# Altium project Mixed_signal_Board_V1.0.PrjPcb
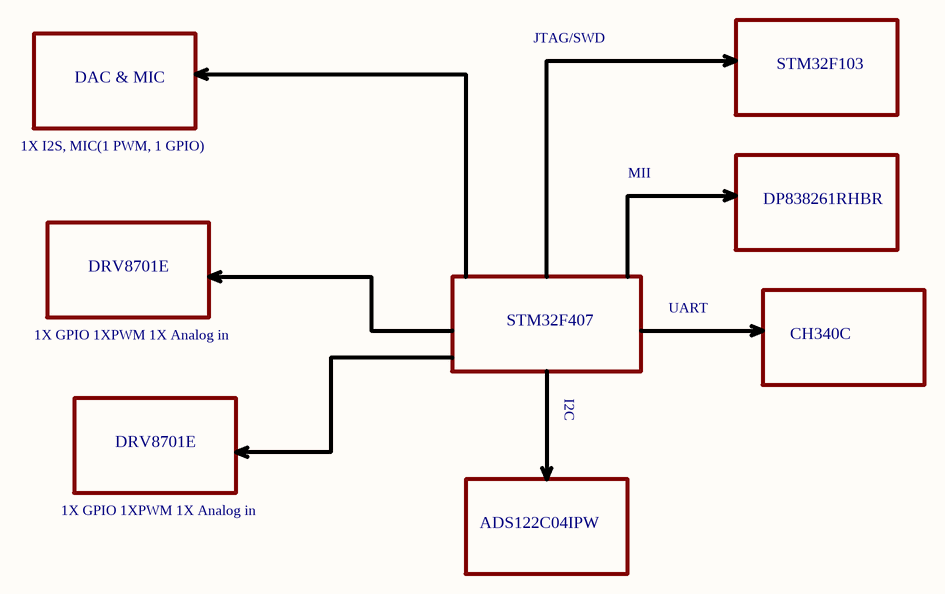
[diagram p0: PCB_Block_diagram.SchDoc]
11 sheets, 184 parts. Net scope: flat (ports and power ports of the same name join across sheets).
Board file: Mixed_signal_Board_V1.0.PcbDoc
Sheets:
  PCB_Block_diagram.SchDoc
  Power_Budget.SchDoc
  STM32F103.SchDoc
  Ethernet PHY.SchDoc
  Motor_Driver_Schematic.SchDoc
  CH340C.SchDoc
  ADC_Chip.SchDoc
  DAC_and_MIC.SchDoc
  Motor_Driver_2.SchDoc
  STM32F407_Controller.SchDoc
  Power_input_and_regulators.SchDoc

## Sheet PCB_Block_diagram.SchDoc
size A4; SheetNumber: 1; SheetTotal: 9

### Notes on the sheet
- JTAG/SWD
- DAC & MIC
- STM32F103
- 1X I2S, MIC(1 PWM, 1 GPIO)
- MII
- DP838261RHBR
- DRV8701E
- STM32F407
- UART
- 1X GPIO 1XPWM 1X Analog in
- I2C
- CH340C
- ADS122C04IPW

## Sheet Power_Budget.SchDoc
size A4; SheetNumber: 2; SheetTotal: 9
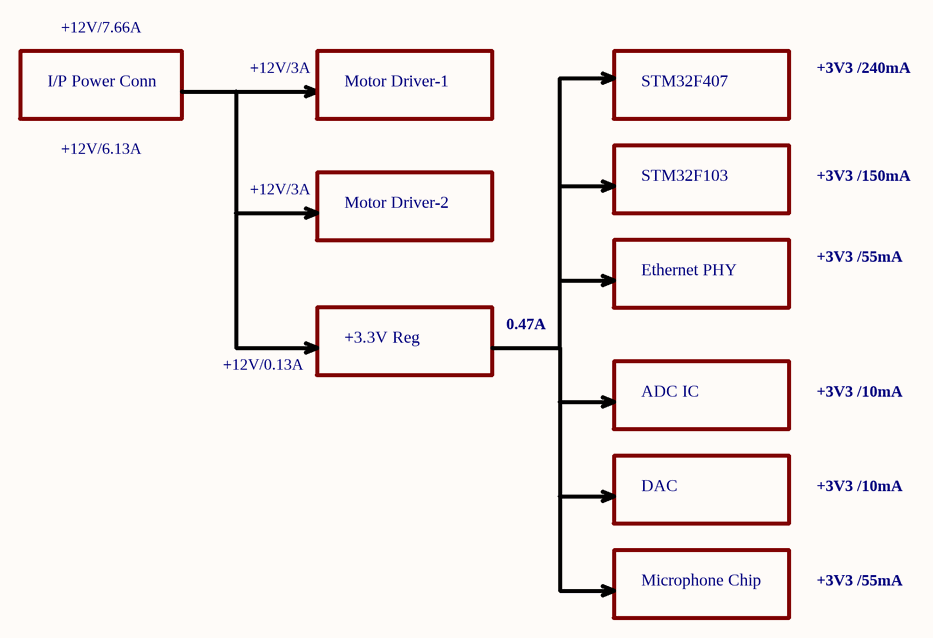
[diagram p1: Power_Budget.SchDoc]

### Notes on the sheet
- I/P Power Conn
- +12V/7.66A
- +12V/3A
- Motor Driver-1
- STM32F407
- +3V3 /240mA
- +12V/6.13A
- Motor Driver-2
- STM32F103
- +3V3 /150mA
- Ethernet PHY
- +3V3 /55mA
- +3.3V Reg
- 0.47A
- +12V/0.13A
- ADC IC
- +3V3 /10mA
- DAC
- Microphone Chip

## Sheet STM32F103.SchDoc
size A4; SheetNumber: 3; SheetTotal: 8
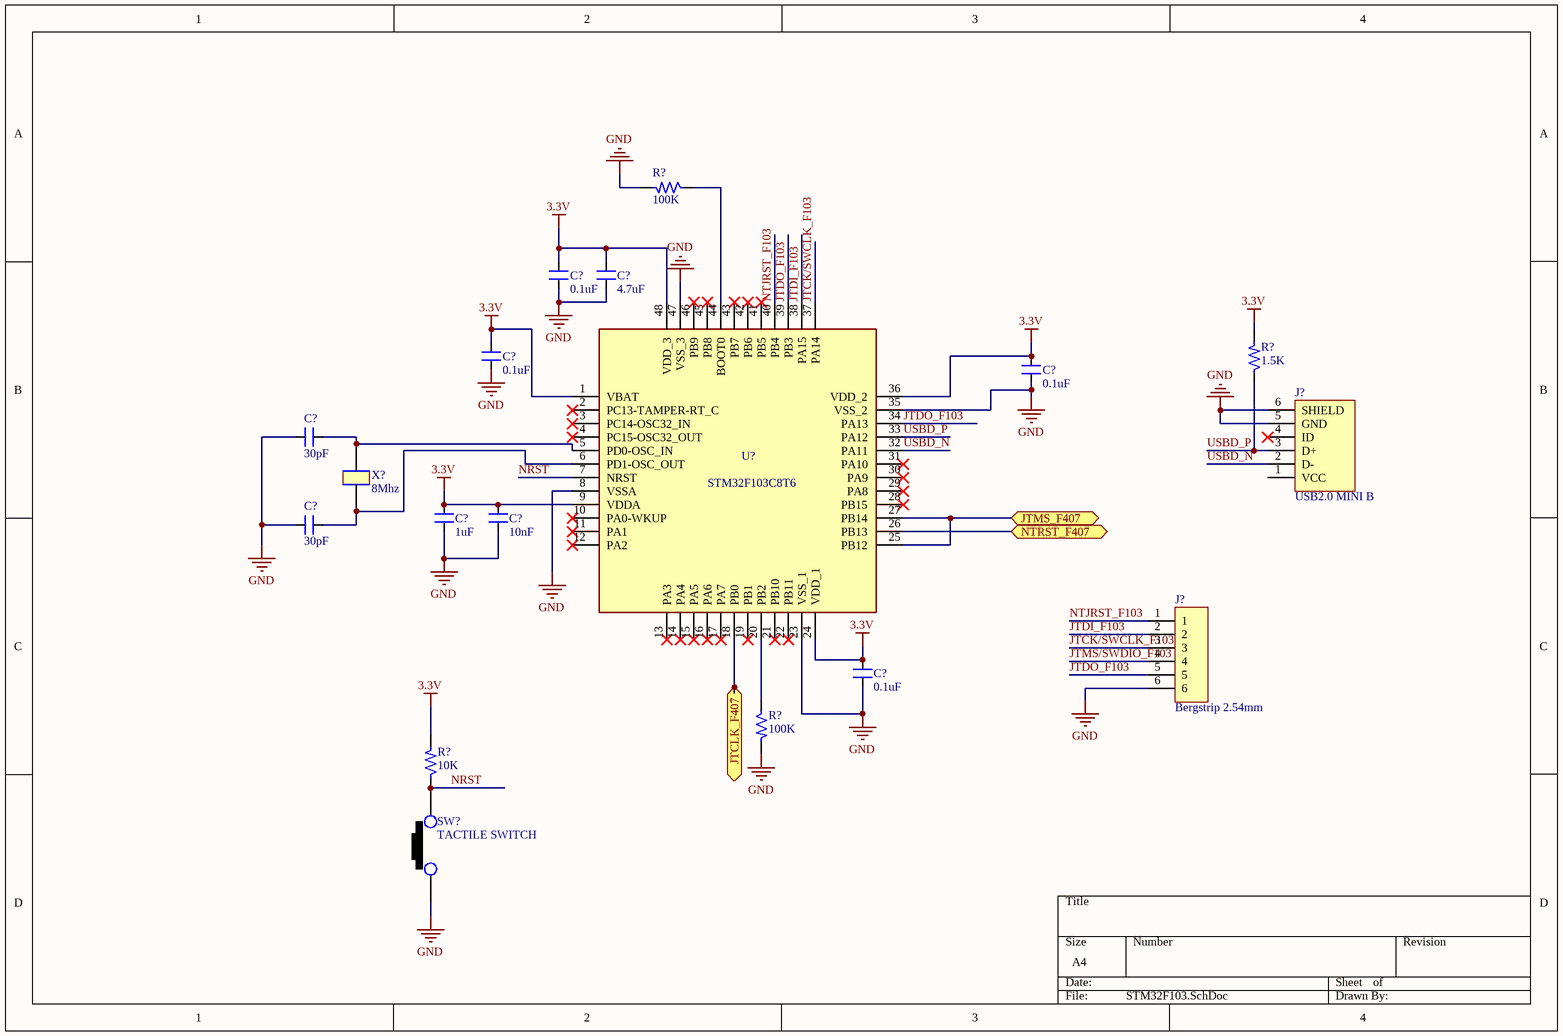
[diagram p2: STM32F103.SchDoc]

### Parts
(Parts that share a designator on the sheet are numbered #1, #2 ... from top to bottom, then left to right.)
C?#1  0.1uF  [CAP_0805]
C?#2  4.7uF  [CAP_0805]
C?#3  0.1uF  [CAP_0805]
C?#4  0.1uF  [CAP_0805]
C?#5  30pF  [CAP_0805]
C?#6  1uF  [CAP_0805]
C?#7  10nF  [CAP_0805]
C?#8  30pF  [CAP_0805]
C?#9  0.1uF  [CAP_0805]
J?#1  USB2.0 MINI B  [CON_690-005-299-043]
J?#2  Bergstrip 2.54mm  [CON6_100_59D78_TH_ST]
R?#1  100K  [RES_0603]
R?#2  1.5K  [RES_0805]
R?#3  100K  [RES_0603]
R?#4  10K  [RES_0805]
SW?#1  TACTILE SWITCH  [SW_342_SMD]
U?#1  STM32F103C8T6  [LQFP-48_19.6_393_58X11_SMD]
X?#1  8Mhz  [XTAL_314_240X47_SMD]

### Ports
JTCLK_F407 (bidir), JTMS_F407 (bidir), NTRST_F407 (bidir)

### Nets
3.3V: C?#1.2 C?#2.2 C?#3.2 C?#4.2 C?#6.2 C?#7.2 C?#9.2 R?#2.2 R?#4.2 U?#1.1(VBAT) U?#1.9(VDDA) U?#1.24(VDD_1) U?#1.36(VDD_2) U?#1.48(VDD_3)
GND: C?#1.1 C?#2.1 C?#3.1 C?#4.1 C?#5.2 C?#6.1 C?#7.1 C?#8.2 C?#9.1 J?#1.5(GND) J?#1.6(SHIELD) J?#2.6 R?#1.2 R?#3.2 SW?#1.1 U?#1.8(VSSA) U?#1.23(VSS_1) U?#1.35(VSS_2) U?#1.47(VSS_3)  [project net SN]
JTCK/SWCLK_F103: J?#2.3 U?#1.37(PA14)
JTCLK_F407: U?#1.18(PB0) ; port JTCLK_F407
JTDI_F103: J?#2.2 U?#1.38(PA15)
JTDO_F103: J?#2.5 U?#1.34(PA13) U?#1.39(PB3)
JTMS/SWDIO_F103: J?#2.4
JTMS_F407: U?#1.25(PB12) U?#1.27(PB14) ; port JTMS_F407
NRST: R?#4.1 SW?#1.2 U?#1.7(NRST)
NTJRST_F103: J?#2.1 U?#1.40(PB4)
NTRST_F407: U?#1.26(PB13) ; port NTRST_F407
USBD_N: J?#1.2(D-) U?#1.32(PA11)
USBD_P: J?#1.3(D+) R?#2.1 U?#1.33(PA12)
NetC?#5_1: C?#5.1 U?#1.5(PD0-OSC_IN) X?#1.2
NetC?#8_1: C?#8.1 U?#1.6(PD1-OSC_OUT) X?#1.1
NetR?#1_1: R?#1.1 U?#1.44(BOOT0)
NetR?#3_1: R?#3.1 U?#1.20(PB2)

Not connected (* = marked no-connect by the designer): J?#1 1(VCC) 4(ID)*; U?#1 2(PC13-TAMPER-RT_C)* 3(PC14-OSC32_IN)* 4(PC15-OSC32_OUT)* 10(PA0-WKUP)* 11(PA1)* 12(PA2)* 13(PA3)* 14(PA4)* 15(PA5)* 16(PA6)* 17(PA7)* 19(PB1)* 21(PB10)* 22(PB11)* 28(PB15)* 29(PA8)* 30(PA9)* 31(PA10)* 41(PB5)* 42(PB6)* 43(PB7)* 45(PB8)* 46(PB9)*

### Library data of the parts
C?#1 C?#4 C?#9 = CAP_0.1uF-50V-10%-0805: 0.1µF ±10% 50V Ceramic Capacitor X7R 0805 (2012 Metric); Manufacturer: Samsung; Manufacturer Part Number: CL21B104KBCNNNC; Alternate Part Number-1: NA; Case/Package: 0805; Supplier-1: SIRICOM; Supplier Part Number-1: 0805B104K500CT
C?#2 = CAP_4.7uF-50V-10%-0805: 4.7µF ±10% 50V Ceramic Capacitor X5R 0805 (2012 Metric); Manufacturer: Yageo; Manufacturer Part Number: GRM21BR61H475KE51L; Alternate Part Number-1: NA; Case/Package: 0805; Supplier-1: SIRICOM; Supplier Part Number-1: CL21A475KBQNNNE
C?#3 = CAP_0.1uF-50V-5%-0805: 0.1µF ±5% 50V Ceramic Capacitor X7R 0805 (2012 Metric); Manufacturer: AVX Corporation; Manufacturer Part Number: 08055C104JAT4A; Alternate Part Number-1: 0805B104M500; Case/Package: 0805; Supplier-1: SIRICOM; Supplier Part Number-1: 0805B104J500CT
C?#5 C?#8 = CAP_30pF-50V-10%-0805: ±10% 50V Ceramic Capacitor C0G, NP0 0805 (2012 Metric); Manufacturer Part Number: C0805C300K5GAC7800; Manufacturer: KEMET; Alternate Part Number: NA; Case/Package: 0805; Supplier-1: Digikey; Supplier Part Number-1: 399-17443-1-ND - Cut Tape (CT)
C?#6 = CAP_1uF-50V-5%-0805: 1µF ±5% 50V Ceramic Capacitor X7R 0805 (2012 Metric); Manufacturer: Samsung; Manufacturer Part Number: CC0805JKX7R9BB105; Alternate Part Number-1: 0805F105M500NT; Case/Package: 0805; Supplier-1: SIRICOM; Supplier Part Number-1: CL21B105KBFNNNE
C?#7 = CAP_10nF-50V-10%-0805: 10000pF ±10% 50V Ceramic Capacitor X7R 0805 (2012 Metric); Manufacturer: Samsung; Manufacturer Part Number: C0805C103K5RECAUTO; Alternate Part Number-1: GRM2195C1H103JA01D; Case/Package: 0805; Supplier-1: SIRICOM; Supplier Part Number-1: 0805B103K500CT
J?#1 = CON_USB2.0-MINIB-SMD: USB - mini B USB 2.0 Receptacle Connector 5 Position Surface Mount, Right Angle; Manufacturer: EDAC; Manufacturer Part Number: 690-005-299-043; Alternate Part Number-1: NA; Case/Package: USB-MINI-B; Supplier-1: LCSC; Supplier Part Number-1: C105424
J?#2 = CON-BS-SKT_6X1-100-ST-TH: 6 Pins, 1 Row 2.54mm Pitch, Straight bergstrip, Female; Manufacturer: Molex; Alternate Part Number-1: NA; Manufacturer Part Number: 22-10-2061; Case/Package: TH-CON; Supplier-1: SP ROAD; Supplier Part Number-1: NA
R?#1 R?#3 = RES_100K-0.1W-1%-0603: 100 kOhms ±1% 0.1W, 1/10W Chip Resistor 0603 (1608 Metric) Automotive AEC-Q200 Thick Film; Manufacturer: Stackpole Electronics; Manufacturer Part Number: RMCF0603FT100K; Alternate Part Number-1: NA; Case/Package: 0603; Supplier-1: Arrow; Supplier Part Number-1: RMCF0603FT100K
R?#2 = RES_1.5K-0.125W-1%-0805: 1.5 kOhms ±1% 0.125W, 1/8W Chip Resistor 0805 (2012 Metric) Thick Film; Manufacturer: TE Connectivity Passive Product; Manufacturer Part Number: CRG0805F1K5; Alternate Part Number-1: NA; Case/Package: 0805; Supplier-1: SIRICOM; Supplier Part Number-1: NA
R?#4 = RES_10K-0.125W-1%-0805: 10 kOhms ±1% 0.125W, 1/8W Chip Resistor 0805 (2012 Metric) Automotive AEC-Q200 Thick Film; Manufacturer: CTS; Manufacturer Part Number: WR08X1002FTL; Case/Package: 0805; Supplier-1: SIRICOM; Supplier Part Number-1: WR08X1002FTL; Alternate Part Number-1: WR08X1002FTL
SW?#1 = SW1_RS-282G05A3-SMRT-SMD: Tactile Switch SPST-NO Top Actuated Surface Mount; Manufacturer: ITT C&K; Alternate Part Number-1: NA; Manufacturer Part Number: RS-282G05A3-SMRT; Case/Package: SMD; Supplier-1: SP ROAD; Supplier Part Number-1: RS-282G05A3-SMRT
U?#1 = IC_STM32F103C8T6: ARM® Cortex®-M3 STM32F1 Microcontroller IC 32-Bit 72MHz 64KB (64K x 8) FLASH 48-LQFP (7x7); Manufacturer: STMicroelectronics; Alternate Part Number-1: NA; Manufacturer Part Number: STM32F103C8T6; Case/Package: LQFP48; Supplier-1: LCSC; Supplier Part Number-1: STM32F103C8T6
X?#1 = XTAL_8MHZ-ECS-80-32-5PX-SMD: 8MHz ±30ppm Crystal 32pF 60 Ohms HC-49/US; Manufacturer: Fox Electronics; Manufacturer Part Number: ECS-80-32-5PX-TR; Alternate Part Number-1: NA; Case/Package: SMD/SMT; Supplier-1: SP ROAD; Supplier Part Number-1: ECS-80-32-5PX-TR

## Sheet Ethernet PHY.SchDoc
size A4; SheetNumber: 4; SheetTotal: 9
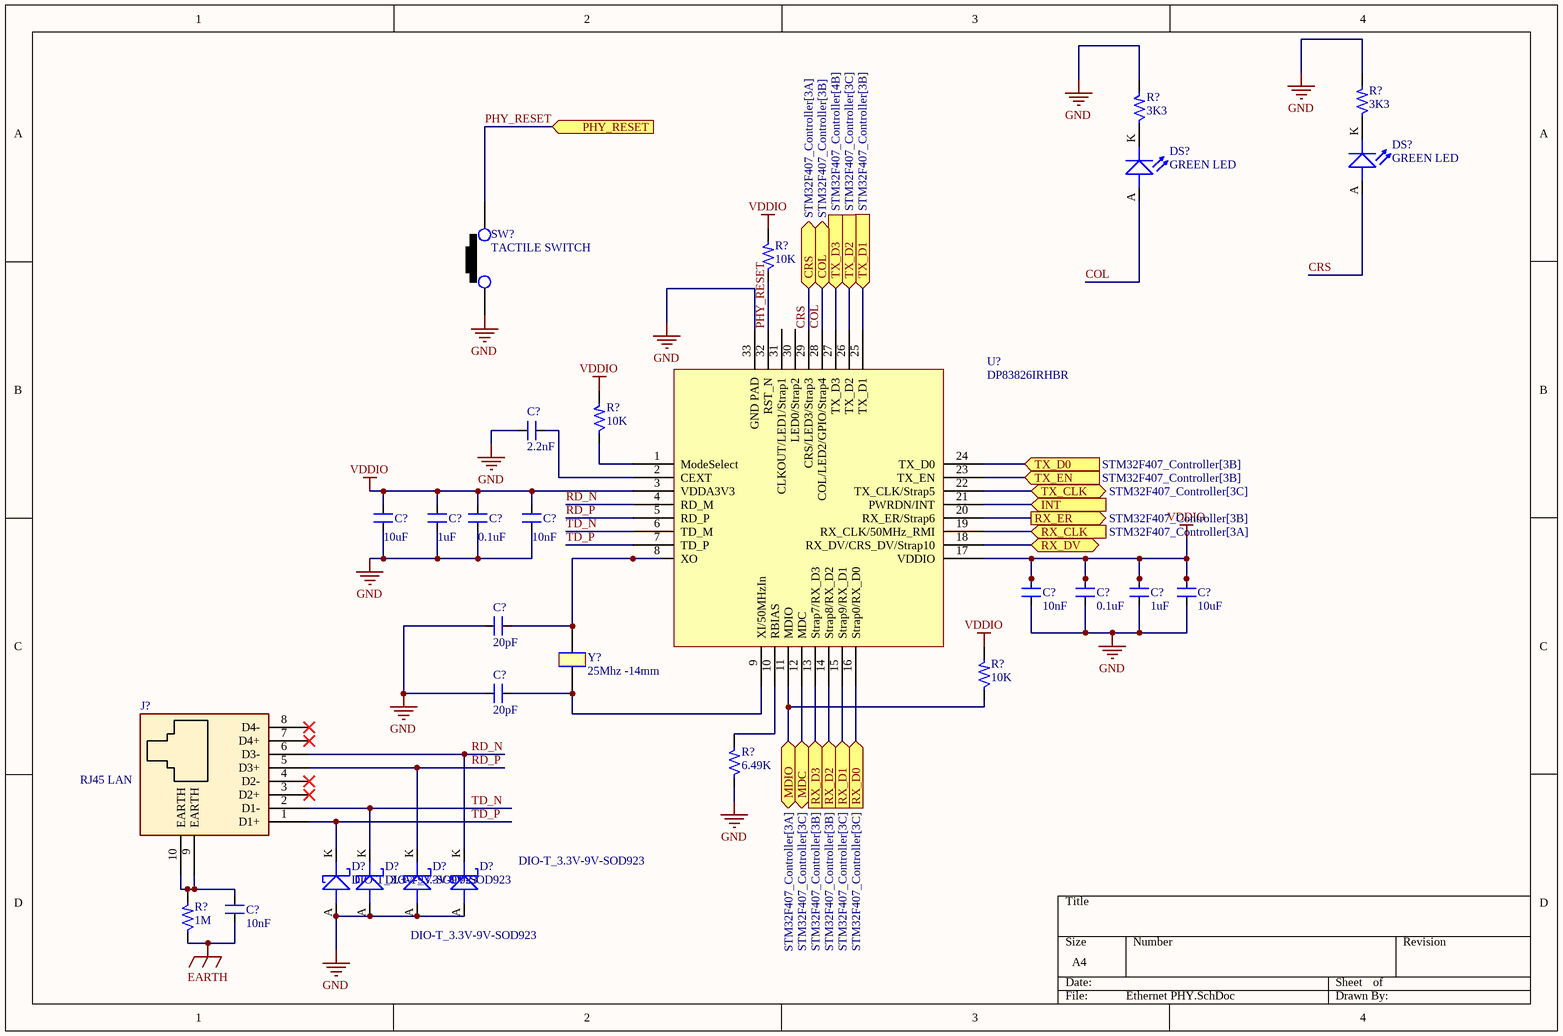
[diagram p3: Ethernet PHY.SchDoc]

### Parts
(Parts that share a designator on the sheet are numbered #1, #2 ... from top to bottom, then left to right.)
C?#10  2.2nF  [CAP_0805]
C?#11  10uF  [CAP_1206]
C?#12  1uF  [CAP_0805]
C?#13  0.1uF  [CAP_0805]
C?#14  10nF  [CAP_0805]
C?#15  10nF  [CAP_0805]
C?#16  0.1uF  [CAP_0805]
C?#17  1uF  [CAP_0805]
C?#18  10uF  [CAP_1206]
C?#19  20pF  [CAP_0805]
C?#20  20pF  [CAP_0805]
C?#21  10nF  [CAP_P196_102X287_H332_RAD_TH]
D?#1  DIO-T_3.3V-9V-SOD923
D?#2  DIO-T_3.3V-9V-SOD923
D?#3  DIO-T_3.3V-9V-SOD923
D?#4  DIO-T_3.3V-9V-SOD923
DS?#1  GREEN LED  [LED_0805]
DS?#2  GREEN LED  [LED_0805]
J?#3  RJ45 LAN  [CON10_P106_RJ45_TH_ST]
R?#5  3K3  [RES_0603]
R?#6  3K3  [RES_0603]
R?#7  10K  [RES_0805]
R?#8  10K  [RES_0805]
R?#9  10K  [RES_0805]
R?#10  6.49K  [RES_0805]
R?#11  1M  [RES_1206]
SW?#2  TACTILE SWITCH  [SW_342_SMD]
U?#2  DP83826IRHBR  [VQFN32_19_218_23X9_SMD]
Y?  25Mhz -14mm  [XTAL_314_240X47_SMD]

### Ports
COL (bidir, see STM32F407_Controller[3B]), CRS (bidir, see STM32F407_Controller[3A]), INT (in), MDC (bidir, see STM32F407_Controller[3C]), MDIO (bidir, see STM32F407_Controller[3A]), PHY_RESET (in), RX_CLK (in, see STM32F407_Controller[3A]), RX_D0 (in, see STM32F407_Controller[3C]), RX_D1 (in, see STM32F407_Controller[3C]), RX_D2 (in, see STM32F407_Controller[3B]), RX_D3 (in, see STM32F407_Controller[3B]), RX_DV (bidir), RX_ER (out, see STM32F407_Controller[3B]), TX_CLK (bidir, see STM32F407_Controller[3C]), TX_D0 (in, see STM32F407_Controller[3B]), TX_D1 (in, see STM32F407_Controller[3B]), TX_D2 (in, see STM32F407_Controller[3C]), TX_D3 (in, see STM32F407_Controller[4B]), TX_EN (in, see STM32F407_Controller[3B])

### Nets
EARTH: C?#21.1 R?#11.1
GND: C?#10.1 C?#11.1 C?#12.1 C?#13.1 C?#14.1 C?#15.2 C?#16.2 C?#17.2 C?#18.2 C?#19.2 C?#20.2 D?#1.A D?#2.A D?#3.A D?#4.A R?#5.2 R?#6.2 R?#10.1 SW?#2.1 U?#2.33(GND_PAD)  [project net SN]
VDDIO: C?#11.2 C?#12.2 C?#13.2 C?#14.2 C?#15.1 C?#16.1 C?#17.1 C?#18.1 R?#7.2 R?#8.2 R?#9.2 U?#2.3(VDDA3V3) U?#2.17(VDDIO)
COL: DS?#2.A(ANODE) U?#2.28(COL/LED2/GPIO/Strap4) ; port COL
CRS: DS?#1.A(ANODE) U?#2.29(CRS/LED3/Strap3) ; port CRS
INT: U?#2.21(PWRDN/INT) ; port INT
MDC: U?#2.12(MDC) ; port MDC
MDIO: R?#9.1 U?#2.11(MDIO) ; port MDIO
PHY_RESET: R?#7.1 SW?#2.2 U?#2.32(RST_N) ; port PHY_RESET
RD_N: D?#4.K J?#3.6(D3-) U?#2.4(RD_M)
RD_P: D?#3.K J?#3.5(D3+) U?#2.5(RD_P)
RX_CLK: U?#2.19(RX_CLK/50MHz_RMI) ; port RX_CLK
RX_D0: U?#2.16(Strap0/RX_D0) ; port RX_D0
RX_D1: U?#2.15(Strap9/RX_D1) ; port RX_D1
RX_D2: U?#2.14(Strap8/RX_D2) ; port RX_D2
RX_D3: U?#2.13(Strap7/RX_D3) ; port RX_D3
RX_DV: U?#2.18(RX_DV/CRS_DV/Strap10) ; port RX_DV
RX_ER: U?#2.20(RX_ER/Strap6) ; port RX_ER
TD_N: D?#2.K J?#3.2(D1-) U?#2.6(TD_M)
TD_P: D?#1.K J?#3.1(D1+) U?#2.7(TD_P)
TX_CLK: U?#2.22(TX_CLK/Strap5) ; port TX_CLK
TX_D0: U?#2.24(TX_D0) ; port TX_D0
TX_D1: U?#2.25(TX_D1) ; port TX_D1
TX_D2: U?#2.26(TX_D2) ; port TX_D2
TX_D3: U?#2.27(TX_D3) ; port TX_D3
TX_EN: U?#2.23(TX_EN) ; port TX_EN
NetC?#10_2: C?#10.2 U?#2.2(CEXT)
NetC?#19_1: C?#19.1 U?#2.8(XO) Y?.2
NetC?#20_1: C?#20.1 U?#2.9(XI/50MHzIn) Y?.1
NetC?#21_2: C?#21.2 J?#3.9(EARTH) J?#3.10(EARTH) R?#11.2
NetDS?#1_K: DS?#1.K(CATHODE) R?#5.1
NetDS?#2_K: DS?#2.K(CATHODE) R?#6.1
NetR?#8_1: R?#8.1 U?#2.1(ModeSelect)
NetR?#10_2: R?#10.2 U?#2.10(RBIAS)

Not connected (* = marked no-connect by the designer): J?#3 3(D2+)* 4(D2-)* 7(D4+)* 8(D4-)*; U?#2 30(LED0/Strap2) 31(CLKOUT/LED1/Strap1)

### Library data of the parts
C?#10 = CAP_2.2nF-50V-10%-0805: 2200pF ±10% 50V Ceramic Capacitor C0G, NP0 0805 (2012 Metric); Manufacturer: KEMET; Manufacturer Part Number: C0805C222K5GEC7800; Alternate Part Number-1: NA; Case/Package: 0805; Supplier-1: SIRICOM; Supplier Part Number-1: 0805N222J500LT
C?#11 C?#18 = CAP_10uF-50V-10%-1206: 10µF ±10% 50V Ceramic Capacitor X7R 1206 (3216 Metric); Manufacturer: KEMET; Manufacturer Part Number: CL31B106KBHNNNE; Alternate Part Number-1: GRT31CR61H106ME01L; Case/Package: 1206; Supplier-1: SIRICOM; Supplier Part Number-1: CC1206KKX5R9BB106
C?#12 C?#17 = CAP_1uF-50V-5%-0805: as C?#6 on sheet STM32F103; Case/Package: 0805; Supplier-1: SIRICOM; Supplier Part Number-1: CL21B105KBFNNNE
C?#13 C?#16 = CAP_0.1uF-50V-10%-0805: as C?#1 on sheet STM32F103; Case/Package: 0805; Supplier-1: SIRICOM; Supplier Part Number-1: 0805B104K500CT
C?#14 C?#15 = CAP_10nF-50V-10%-0805: as C?#7 on sheet STM32F103; Case/Package: 0805; Supplier-1: SIRICOM; Supplier Part Number-1: 0805B103K500CT
C?#19 C?#20 = CAP_20pF-50V-10%-0805: ±10% 50V Ceramic Capacitor C0G, NP0 0805 (2012 Metric); Manufacturer: AVX Corporation; Manufacturer Part Number: 08055A200KAT2A; Alternate Part Number-1: NA; Case/Package: 0805; Supplier-1: Digikey; Supplier Part Number-1: 478-11887-1-ND - Cut Tape (CT)
C?#21 = CAP_10nF-1KV-10%-RAD-TH: 10000pF ±10% 1000V (1kV) Ceramic Capacitor X7R Radial; Manufacturer: Yageo; Manufacturer Part Number: RDER73A103K2K1H03B; Alternate Part Number-1: NA; Case/Package: TH; Supplier-1: SP ROAD; Supplier Part Number-1: RDER73A103K2K1H03B
DS?#1 DS?#2 = LED_GREEN-2.2-20mA-0805: Green 569nm LED Indication - Discrete 2.1V 0805 (2012 Metric); Manufacturer: Vishay Lite-On; Manufacturer Part Number: LTST-C171GKT; Alternate Part Number-1: NA; Case/Package: 0805; Supplier-1: SP ROAD; Supplier Part Number-1: LTST-C171GKT
J?#3 = CON-SKT-RJ_8C8P-RA-TH: 8 Pins, 2 Row 2.54mm Pitch, right angle Connector, male; Manufacturer: Assmann; Manufacturer Part Number: A-2004-2-4-LPS-N-R; Alternate Part Number-1: NA; Case/Package: TH-CON; Supplier-1: SP ROAD; Supplier Part Number-1: A-2004-2-4-LPS-N-R
R?#5 R?#6 = RES_3.3K-0.1W-1%-0603: 3.3 kOhms ±1% 0.1W, 1/10W Chip Resistor 0603 (1608 Metric) Automotive AEC-Q200 Thick Film; Manufacturer: Wilson; Manufacturer Part Number: WR06X3301FTL; Alternate Part Number-1: 0603WAF3301T5E; Case/Package: 0603; Supplier-1: SIRICOM; Supplier Part Number-1: WR06X3301FTL
R?#7-R?#9 = RES_10K-0.125W-1%-0805: as R?#4 on sheet STM32F103; Case/Package: 0805; Supplier-1: SIRICOM; Supplier Part Number-1: WR08X1002FTL; Alternate Part Number-1: WR08X1002FTL
R?#10 = RES_6.49K-0.125W-1%-0805: 6.49 kOhms ±1% 0.125W, 1/8W Chip Resistor 0805 (2012 Metric) Moisture Resistant Thick Film; Manufacturer: Stackpole Electronics; Manufacturer Part Number: RC0805FR-076K49L; Alternate Part Number-1: NA; Case/Package: 0805; Supplier-1: SIRICOM; Supplier Part Number-1: WRO8X6491FTL
R?#11 = RES_1M-0.25W-1%-1206: 1 MOhms ±1% 0.25W, 1/4W Chip Resistor 1206 (3216 Metric) Automotive AEC-Q200, High Voltage Thick Film; Manufacturer: Walsin; Manufacturer Part Number: WR12X1004FTL; Alternate Part Number-1: NA; Case/Package: 1206; Supplier-1: SIRICOM; Supplier Part Number-1: WR12X1004FTL
SW?#2 = SW1_RS-282G05A3-SMRT-SMD: as SW?#1 on sheet STM32F103; Manufacturer Part Number: RS-282G05A3-SMRT; Case/Package: SMD; Supplier-1: SP ROAD; Supplier Part Number-1: RS-282G05A3-SMRT
U?#2 = IC_DP83826IRHBR: Ethernet ICs Low latency 10/100-Mbps PHY, MII interface and enhanced mode with an industrial temperature range 32-VQFN -40 to 85; Manufacturer: Texas Instruments; Alternate Part Number-1: NA; Manufacturer Part Number: DP83826IRHBR; Case/Package: 32-VQFN; Supplier-1: Mouser; Supplier Part Number-1: 595-DP83826IRHBR
Y? = XTAL_25Mhz-FOXSDLF/250F-20: 25MHz ±30ppm Crystal 20pF 30 Ohms HC-49/US; Manufacturer: Abracon; Alternate Part Number-1: NA; Manufacturer Part Number: FOXSDLF/250F-20; Case/Package: SMD; Supplier-1: MOUSER; Supplier Part Number-1: FOXSDLF/250F-20

## Sheet Motor_Driver_Schematic.SchDoc
size A4; SheetNumber: 5; SheetTotal: 10
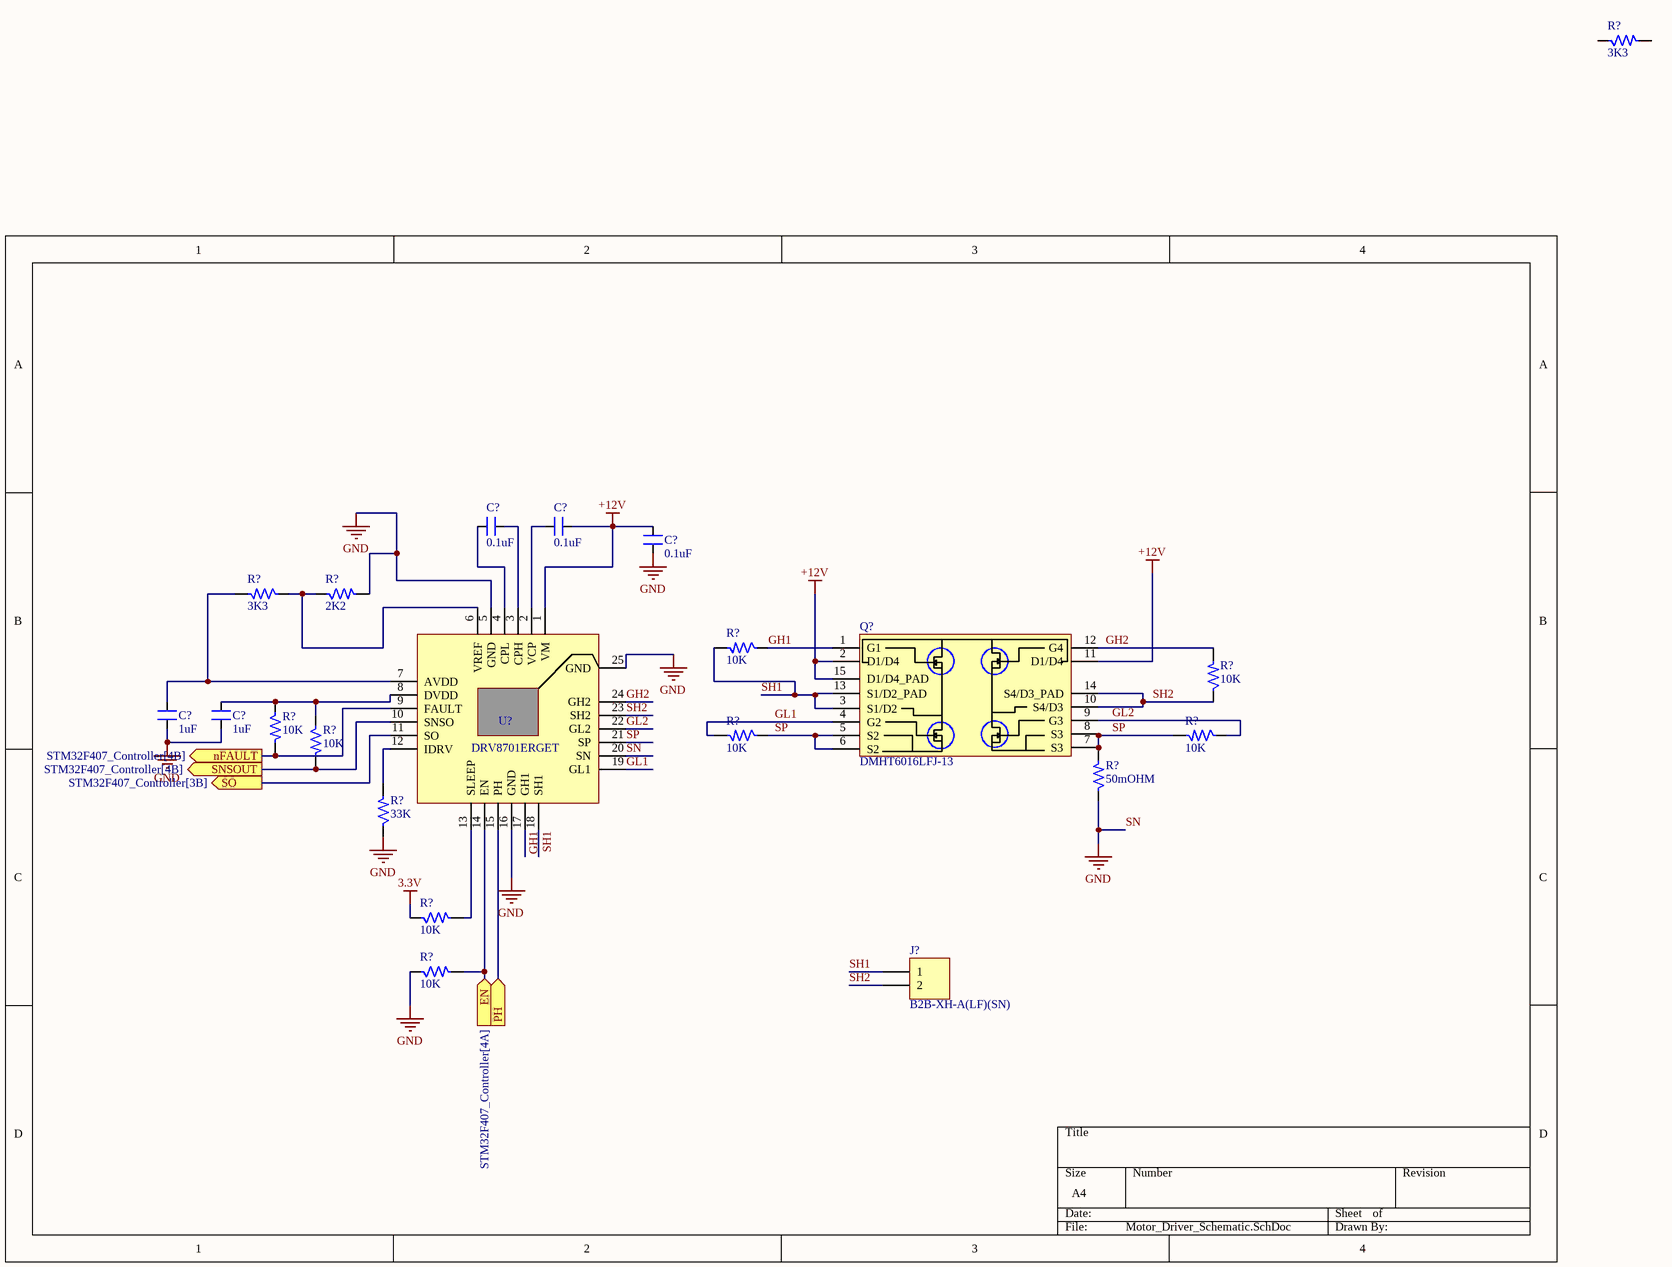
[diagram p4: Motor_Driver_Schematic.SchDoc]

### Parts
(Parts that share a designator on the sheet are numbered #1, #2 ... from top to bottom, then left to right.)
C?#22  0.1uF  [CAP_0805]
C?#23  0.1uF  [CAP_0805]
C?#24  0.1uF  [CAP_0805]
C?#25  1uF  [CAP_0805]
C?#26  1uF  [CAP_0805]
J?#4  B2B-XH-A(LF)(SN)  [CON2_100_B2B-XH-A_TH_ST]
Q?#1  DMHT6016LFJ-13  [DFN5045-12_33_212_27X15_SMD_1]
R?#12  3K3  [RES_0603]
R?#13  3K3  [RES_0603]
R?#14  2K2  [RES_0603]
R?#15  10K  [RES_0805]
R?#16  10K  [RES_0805]
R?#17  10K  [RES_0805]
R?#18  10K  [RES_0805]
R?#19  10K  [RES_0805]
R?#20  10K  [RES_0805]
R?#21  50mOHM  [RES_2512]
R?#22  33K  [RES_0805]
R?#23  10K  [RES_0603]
R?#24  10K  [RES_0805]
U?#3  DRV8701ERGET  [VFQFN24_19.6_196_12X32_SMD_1]

### Ports
EN (in, see STM32F407_Controller[4A]), nFAULT (out, see STM32F407_Controller[4B]), PH (in), SNSOUT (out, see STM32F407_Controller[4B]), SO (out, see STM32F407_Controller[3B])

### Nets
3.3V: R?#23.1
+12V: C?#23.1 C?#24.2 Q?#1.2(D1/D4) Q?#1.11(D1/D4) Q?#1.15(D1/D4_PAD) U?#3.1(VM)
SN: C?#24.1 C?#25.1 C?#26.1 R?#14.2 R?#21.1 R?#22.1 R?#24.1 U?#3.5(GND) U?#3.16(GND) U?#3.20(SN) U?#3.25(GND)  [also labelled GND]
EN: R?#24.2 U?#3.14(EN) ; port EN
GH1: Q?#1.1(G1) R?#15.1 U?#3.17(GH1)
GH2: Q?#1.12(G4) R?#17.2 U?#3.24(GH2)
GL1: Q?#1.4(G2) R?#19.2 U?#3.19(GL1)
GL2: Q?#1.9(G3) R?#20.1 U?#3.22(GL2)
nFAULT: R?#16.2 U?#3.9(FAULT) ; port nFAULT
PH: U?#3.15(PH) ; port PH
SH1: J?#4.1 Q?#1.3(S1/D2) Q?#1.13(S1/D2_PAD) R?#15.2 U?#3.18(SH1)
SH2: J?#4.2 Q?#1.10(S4/D3) Q?#1.14(S4/D3_PAD) R?#17.1 U?#3.23(SH2)
SNSOUT: R?#18.2 U?#3.10(SNSO) ; port SNSOUT
SO: U?#3.11(SO) ; port SO
SP: Q?#1.5(S2) Q?#1.6(S2) Q?#1.7(S3) Q?#1.8(S3) R?#19.1 R?#20.2 R?#21.2 U?#3.21(SP)
NetC?#22_1: C?#22.1 U?#3.3(CPH)
NetC?#22_2: C?#22.2 U?#3.4(CPL)
NetC?#23_2: C?#23.2 U?#3.2(VCP)
NetC?#25_2: C?#25.2 R?#13.2 U?#3.7(AVDD)
NetC?#26_2: C?#26.2 R?#16.1 R?#18.1 U?#3.8(DVDD)
NetR?#13_1: R?#13.1 R?#14.1 U?#3.6(VREF)
NetR?#22_2: R?#22.2 U?#3.12(IDRV)
NetR?#23_2: R?#23.2 U?#3.13(SLEEP)

Not connected (* = marked no-connect by the designer): R?#12 1 2

### Library data of the parts
C?#22-C?#24 = CAP_0.1uF-50V-20%-0805: 0.1µF ±20% 50V Ceramic Capacitor X7R 0805 (2012 Metric); Manufacturer: Samsung Electro-Mechanics; Manufacturer Part Number: CL21B104MBCNNNC; Alternate Part Number-1: NA; Case/Package: 0805; Supplier-1: SIRICOM; Supplier Part Number-1: 0805B104K500CT
C?#25 C?#26 = CAP_1uF-50V-5%-0805: as C?#6 on sheet STM32F103; Case/Package: 0805; Supplier-1: SIRICOM; Supplier Part Number-1: CL21B105KBFNNNE
J?#4 = CON-PLG_2X1-100-ST-TH: 2 Pins, 1 Row 2.54mm Pitch, Straight Connector, male; Manufacturer: JST; Mating Part Number: XHP-2; Crimp Part Number: ASXHSXH22K51; Alternate Part Number-1: NA; Manufacturer Part Number: B2B-XH-A(LF)(SN); Case/Package: TH-CON; Supplier-1: SP ROAD; Supplier Part Number-1: B2B-XH-A(LF)(SN)
Q?#1 = MOSFET-N_60V-14.8A-V-DFN5045-12: Mosfet Array 4 N-Channel 14.8A (Ta) Surface Mount V-DFN5045-12; Manufacturer: ON Semiconductor; Alternate Part Number-1: DMHT3006LFJ-13; Manufacturer Part Number: DMHT6016LFJ-13; Case/Package: DFN5045-12; Supplier-1: LCSC; Supplier Part Number-1: C460986
R?#12 R?#13 = RES_3.3K-0.1W-1%-0603: as R?#5 on sheet Ethernet PHY; Case/Package: 0603; Supplier-1: SIRICOM; Supplier Part Number-1: WR06X3301FTL
R?#14 = RES_2K2-0.1W-5%-0603: 2.2 kOhms ±5% 0.1W, 1/10W Chip Resistor 0603 (1608 Metric) Automotive AEC-Q200 Thick Film; Manufacturer: Stackpole Electronics; Manufacturer Part Number: ERJ-3GEYJ222V; Alternate Part Number-1: WR06X2201FTL; Case/Package: 0603; Supplier-1: SIRICOM; Supplier Part Number-1: WR06X2201FTL
R?#15-R?#20 R?#24 = RES_10K-0.125W-1%-0805: as R?#4 on sheet STM32F103; Case/Package: 0805; Supplier-1: SIRICOM; Supplier Part Number-1: WR08X1002FTL; Alternate Part Number-1: WR08X1002FTL
R?#21 = RES_50mOhm-2W-1%-2512: 50 mOhms ±1% 2W Chip Resistor 2512 (6432 Metric) Automotive AEC-Q200, Current Sense, Moisture Resistant Metal Element; Manufacturer: Yageo; Manufacturer Part Number: PA2512FKF7W0R05E; Alternate Part Number-1: PMR100HZPFU5L00; Case/Package: 2512; Supplier-1: SIRICOM; Supplier Part Number-1: LR2512-22R060F1
R?#22 = RES_33K-0.125W-1%-0805: Thick Film Resistors - SMD 33KOhms 1/8W 150V33 kOhms ±1% 0.125W, 1/8W Chip Resistor 0805 (2012 Metric) Thick Film; Manufacturer: Vishay BCcomponents; Manufacturer Part Number: CRG0805F33K; Alternate Part Number-1: NA; Case/Package: 0805; Supplier-1: SIRICOM; Supplier Part Number-1: WR08X3302FTL
R?#23 = RES_10K-0.1W-1%-0603: 10 kOhms ±1% 0.1W, 1/10W Chip Resistor 0603 (1608 Metric) Automotive AEC-Q200 Thick Film; Manufacturer: Walsin; Manufacturer Part Number: WR06X1002FTL; Alternate Part Number-1: 0603WAJ0103T5E; Case/Package: 0603; Supplier-1: SIRICOM; Supplier Part Number-1: WR06X1002FTL
U?#3 = IC_DRV8701ERGET: Motor Driver Power MOSFET Parallel 24-VQFN (4x4); Manufacturer: Texas Instruments; Alternate Part Number-1: NA; Manufacturer Part Number: DRV8701ERGET; Case/Package: VFQFN24; Supplier-1: ARROW; Supplier Part Number-1: DRV8701ERGET

## Sheet CH340C.SchDoc
size A4; SheetNumber: 6; SheetTotal: 9
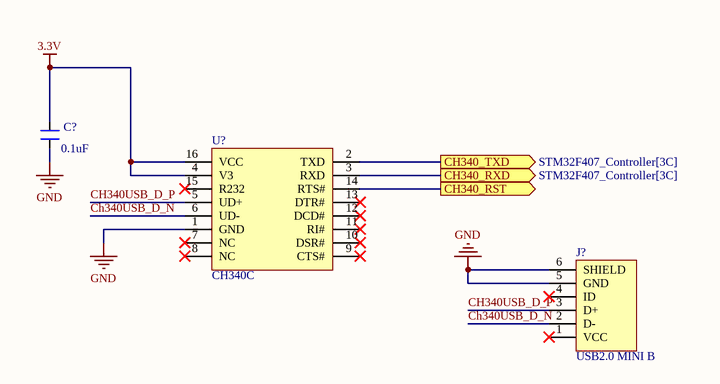
[diagram p5: CH340C.SchDoc]

### Parts
(Parts that share a designator on the sheet are numbered #1, #2 ... from top to bottom, then left to right.)
C?#27  0.1uF  [CAP_0805]
J?#5  USB2.0 MINI B  [CON_690-005-299-043]
U?#4  CH340C  [SOIC16_50_284_25X90_SMT]

### Ports
CH340_RST (out), CH340_RXD (out, see STM32F407_Controller[3C]), CH340_TXD (out, see STM32F407_Controller[3C])

### Nets
3.3V: C?#27.2 U?#4.4(V3) U?#4.16(VCC)
GND: C?#27.1 J?#5.5(GND) J?#5.6(SHIELD) U?#4.1(GND)  [project net SN]
CH340_RST: U?#4.14(RTS#) ; port CH340_RST
CH340_RXD: U?#4.3(RXD) ; port CH340_RXD
CH340_TXD: U?#4.2(TXD) ; port CH340_TXD
Ch340USB_D_N: J?#5.2(D-) U?#4.6(UD-)
CH340USB_D_P: J?#5.3(D+) U?#4.5(UD+)

Not connected (* = marked no-connect by the designer): J?#5 1(VCC)* 4(ID)*; U?#4 7(NC)* 8(NC)* 9(CTS#)* 10(DSR#)* 11(RI#)* 12(DCD#)* 13(DTR#)* 15(R232)*

### Library data of the parts
C?#27 = CAP_0.1uF-50V-10%-0805: as C?#1 on sheet STM32F103; Case/Package: 0805; Supplier-1: SIRICOM; Supplier Part Number-1: 0805B104K500CT
J?#5 = CON_USB2.0-MINIB-SMD: as J?#1 on sheet STM32F103; Case/Package: USB-MINI-B; Supplier-1: LCSC; Supplier Part Number-1: C105424
U?#4 = IC_CH340C: USB Bridge, USB to UART USB 2.0 UART Interface; Manufacturer: Olimex; Alternate Part Number-1: NA; Manufacturer Part Number: CH340C; Case/Package: SOIC16; Supplier-1: LCSC; Supplier Part Number-1: C84681

## Sheet ADC_Chip.SchDoc
size A4; SheetNumber: 7; SheetTotal: 10
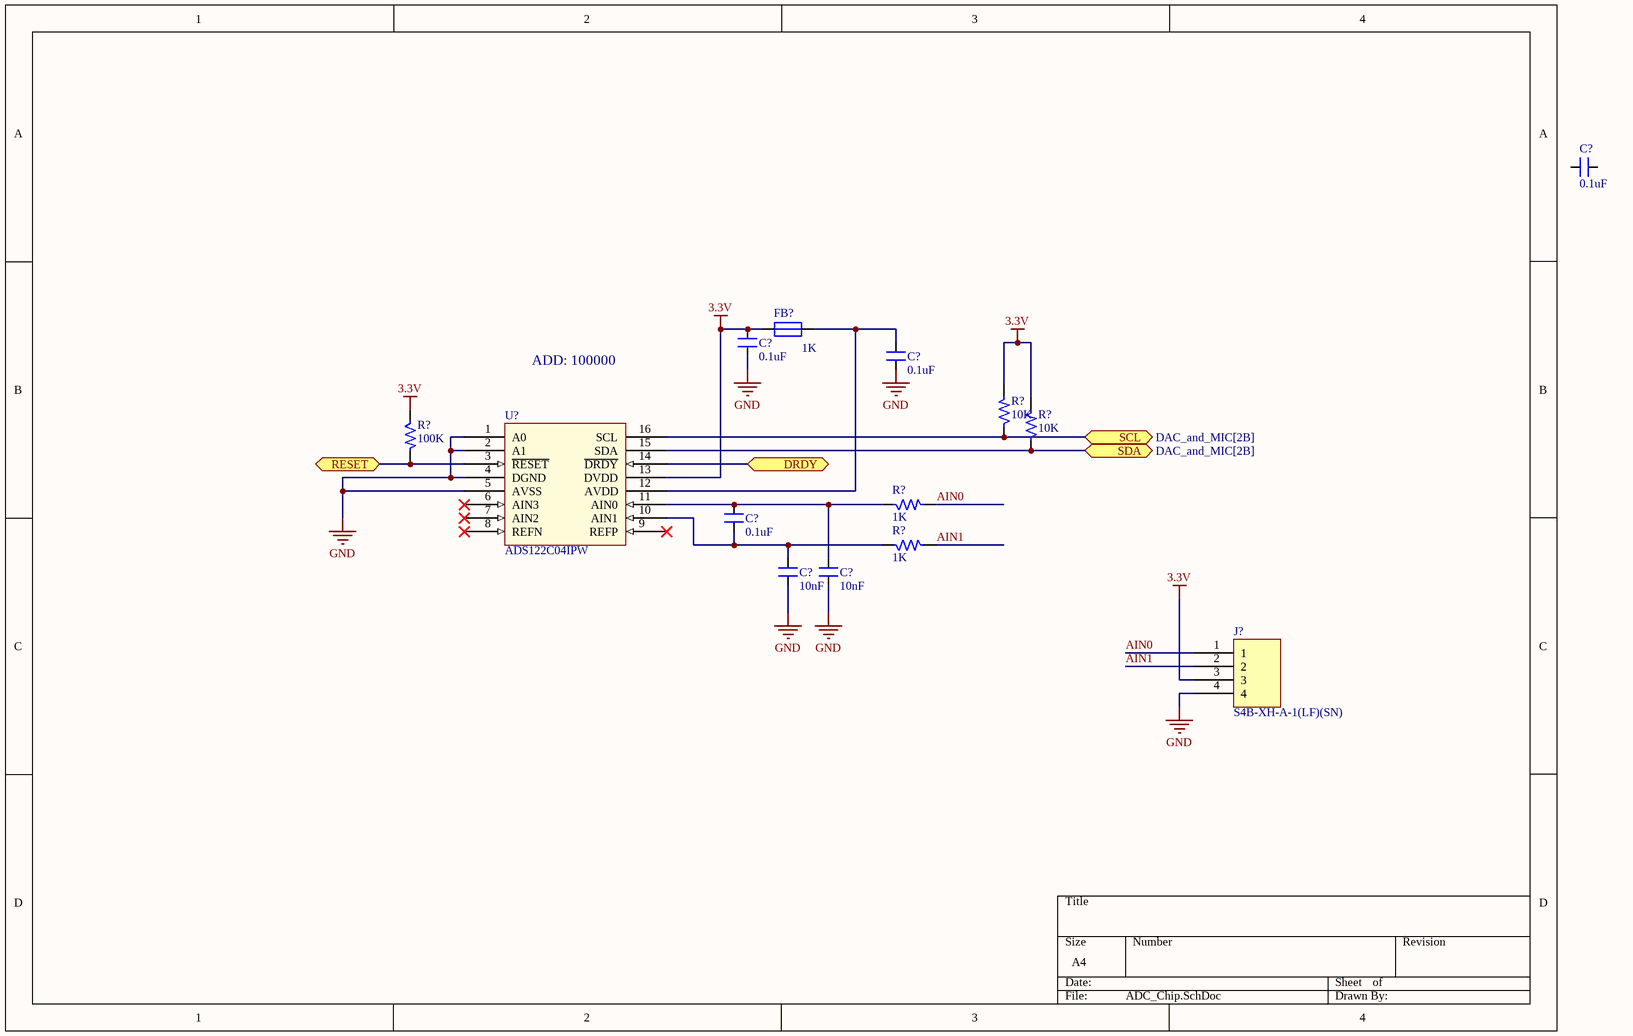
[diagram p6: ADC_Chip.SchDoc]

### Parts
(Parts that share a designator on the sheet are numbered #1, #2 ... from top to bottom, then left to right.)
C?#28  0.1uF  [CAP_0805]
C?#29  0.1uF  [CAP_0805]
C?#30  0.1uF  [CAP_0805]
C?#31  0.1uF  [CAP_0805]
C?#32  10nF  [CAP_0805]
C?#33  10nF  [CAP_0805]
FB?#1  1K  [IND_0805]
J?#6  S4B-XH-A-1(LF)(SN)  [CON4_100_S4B-XH-A_TH_RA]
R?#25  100K  [RES_0805]
R?#26  10K  [RES_0805]
R?#27  10K  [RES_0805]
R?#28  1K  [RES_0805]
R?#29  1K  [RES_0805]
U?#5  ADS122C04IPW  [TSSOP16_25-59_294_54X14_SMT]

### Ports
DRDY (bidir), RESET (bidir), SCL (bidir, see DAC_and_MIC[2B]), SDA (bidir, see DAC_and_MIC[2B])

### Nets
3.3V: C?#29.1 FB?#1.1 J?#6.3 R?#25.1 R?#26.2 R?#27.2 U?#5.13(DVDD)
GND: C?#29.2 C?#30.2 C?#32.2 C?#33.2 J?#6.4 U?#5.1(A0) U?#5.2(A1) U?#5.4(DGND) U?#5.5(AVSS)  [project net SN]
AIN0: J?#6.1 R?#28.2
AIN1: J?#6.2 R?#29.2
DRDY: U?#5.14(~{DRDY}) ; port DRDY
RESET: R?#25.2 U?#5.3(~{RESET}) ; port RESET
SCL: R?#26.1 U?#5.16(SCL) ; port SCL
SDA: R?#27.1 U?#5.15(SDA) ; port SDA
NetC?#30_1: C?#30.1 FB?#1.2 U?#5.12(AVDD)
NetC?#31_1: C?#31.1 C?#32.1 R?#29.1 U?#5.10(AIN1)
NetC?#31_2: C?#31.2 C?#33.1 R?#28.1 U?#5.11(AIN0)

Not connected (* = marked no-connect by the designer): C?#28 1 2; U?#5 6(AIN3)* 7(AIN2)* 8(REFN)* 9(REFP)*

### Notes on the sheet
- ADD: 100000

### Library data of the parts
C?#28-C?#31 = CAP_0.1uF-50V-10%-0805: as C?#1 on sheet STM32F103; Case/Package: 0805; Supplier-1: SIRICOM; Supplier Part Number-1: 0805B104K500CT
C?#32 C?#33 = CAP_10nF-50V-10%-0805: as C?#7 on sheet STM32F103; Case/Package: 0805; Supplier-1: SIRICOM; Supplier Part Number-1: 0805B103K500CT
FB?#1 = FB_1K-100MHZ-1.6A-0805: 1 kOhms @ 100MHz 1 Power Line Ferrite Bead 0805 (2012 Metric) 1.6A; Manufacturer: Laird; Manufacturer Part Number: BLM21SP102SH1D; Alternate Part Number-1: NA; Case/Package: 0805; Supplier-1: SIRICOM; Supplier Part Number-1: ACMS201209A102
J?#6 = CON-PLG_4X1-100-RA-TH: 4 Pins, 1 Row 2.54mm Pitch, right angle Connector, male; Manufacturer: Wurth Electronics; Mating Part Number: XHP-4; Crimp Part Number: ASXHSXH22K51; Alternate Part Number-1: NA; Manufacturer Part Number: S4B-XH-A-1(LF)(SN); Case/Package: TH-CON; Supplier-1: LCSC; Supplier Part Number-1: S4B-XH-A
R?#25 = RES_100K-0.125W-1%-0805: 100 kOhms ±1% 0.125W, 1/8W Chip Resistor 0805 (2012 Metric) Automotive AEC-Q200 Thick Film; Manufacturer: Walsin; Manufacturer Part Number: WR08X1003FTL; Alternate Part Number-1: NA; Case/Package: 0805; Supplier-1: SIRICOM; Supplier Part Number-1: WR08X1003FTL
R?#26 R?#27 = RES_10K-0.125W-1%-0805: as R?#4 on sheet STM32F103; Case/Package: 0805; Supplier-1: SIRICOM; Supplier Part Number-1: WR08X1002FTL; Alternate Part Number-1: WR08X1002FTL
R?#28 R?#29 = RES_1K-0.125W-1%-0805: 1 kOhms ±1% 0.125W, 1/8W Chip Resistor 0805 (2012 Metric) Moisture Resistant Thick Film; Manufacturer: Walsin; Manufacturer Part Number: WR08X1001FTL; Case/Package: 0805; Supplier-1: SP ROAD; Supplier Part Number-1: RC0805JR-071KL; Alternate Part Number-1: WR08X1001FTL
U?#5 = IC_ADS122C04IPW: 24 Bit Analog to Digital Converter 4 Input 1 Sigma-Delta 16-TSSOP; Manufacturer: Texas Instruments; Alternate Part Number-1: NA; Manufacturer Part Number: ADS122C04IPW; Case/Package: TSSOP16; Supplier-1: MOUSER; Supplier Part Number-1: ADS122C04IPW

## Sheet DAC_and_MIC.SchDoc
size A4; SheetNumber: 8; SheetTotal: 8
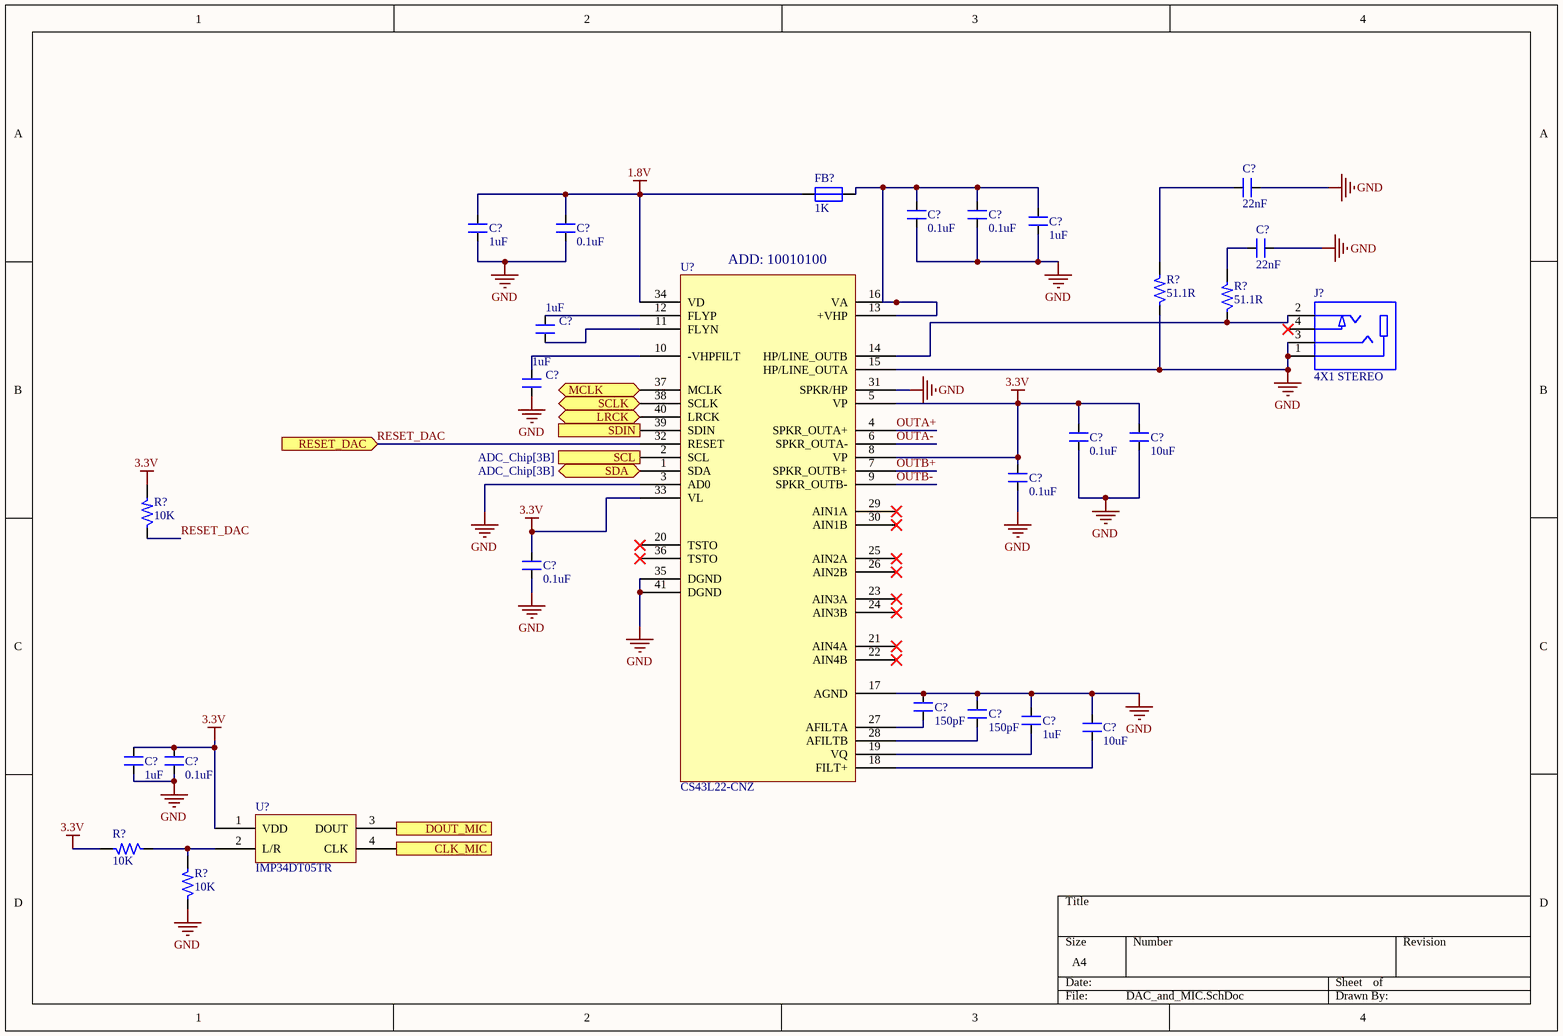
[diagram p7: DAC_and_MIC.SchDoc]

### Parts
(Parts that share a designator on the sheet are numbered #1, #2 ... from top to bottom, then left to right.)
C?#34  22nF
C?#35  0.1uF  [CAP_0805]
C?#36  0.1uF  [CAP_0805]
C?#37  1uF  [CAP_0805]
C?#38  1uF  [CAP_0805]
C?#39  0.1uF  [CAP_0805]
C?#40  22nF
C?#41  1uF  [CAP_0805]
C?#42  1uF  [CAP_0805]
C?#43  0.1uF  [CAP_0805]
C?#44  10uF  [CAP_1206]
C?#45  0.1uF  [CAP_0805]
C?#46  0.1uF  [CAP_0805]
C?#47  150pF
C?#48  1uF  [CAP_0805]
C?#49  150pF
C?#50  10uF  [CAP_1206]
C?#51  1uF  [CAP_0805]
C?#52  0.1uF  [CAP_0805]
FB?#2  1K  [IND_0805]
J?#7  4X1 STEREO  [CON_SJ-2504A-SMT-TR_SMD]
R?#30  51.1R  [RES_0603]
R?#31  51.1R  [RES_0603]
R?#32  10K  [RES_0805]
R?#33  10K  [RES_0805]
R?#34  10K  [RES_0805]
U?#6  CS43L22-CNZ  [QFN40_19_284_33X9_SMD]
U?#7  IMP34DT05TR

### Ports
CLK_MIC (in), DOUT_MIC (out), LRCK (bidir), MCLK (bidir), RESET_DAC (in), SCL (in, see ADC_Chip[3B]), SCLK (bidir), SDA (bidir, see ADC_Chip[3B]), SDIN (in)

### Nets
1.8V: C?#38.1 C?#39.2 FB?#2.1 U?#6.34(VD)
3.3V: C?#43.2 C?#44.2 C?#45.2 C?#46.2 C?#51.2 C?#52.2 R?#32.2 R?#33.2 U?#6.5(VP) U?#6.8(VP) U?#6.33(VL) U?#7.1(VDD)
GND: C?#34.1 C?#35.1 C?#36.1 C?#37.1 C?#38.2 C?#39.1 C?#40.1 C?#42.2 C?#43.1 C?#44.1 C?#45.1 C?#46.1 C?#47.2 C?#48.2 C?#49.2 C?#50.2 C?#51.1 C?#52.1 J?#7.1 J?#7.3 R?#30.1 R?#34.1 U?#6.3(AD0) U?#6.15(HP/LINE_OUTA) U?#6.17(AGND) U?#6.31(SPKR/HP) U?#6.35(DGND) U?#6.41(DGND)  [project net SN]
CLK_MIC: U?#7.4(CLK) ; port CLK_MIC
DOUT_MIC: U?#7.3(DOUT) ; port DOUT_MIC
LRCK: U?#6.40(LRCK) ; port LRCK
MCLK: U?#6.37(MCLK) ; port MCLK
OUTA+: U?#6.4(SPKR_OUTA+)
OUTA-: U?#6.6(SPKR_OUTA-)
OUTB+: U?#6.7(SPKR_OUTB+)
OUTB-: U?#6.9(SPKR_OUTB-)
RESET_DAC: U?#6.32(RESET) ; port RESET_DAC
RESET_DAC: R?#32.1  [a separate net that carries the same name]
SCL: U?#6.2(SCL) ; port SCL
SCLK: U?#6.38(SCLK) ; port SCLK
SDA: U?#6.1(SDA) ; port SDA
SDIN: U?#6.39(SDIN) ; port SDIN
NetC?#34_2: C?#34.2 R?#30.2
NetC?#35_2: C?#35.2 C?#36.2 C?#37.2 FB?#2.2 U?#6.13(+VHP) U?#6.16(VA)
NetC?#40_2: C?#40.2 R?#31.2
NetC?#41_1: C?#41.1 U?#6.12(FLYP)
NetC?#41_2: C?#41.2 U?#6.11(FLYN)
NetC?#42_1: C?#42.1 U?#6.10(-VHPFILT)
NetC?#47_1: C?#47.1 U?#6.27(AFILTA)
NetC?#48_1: C?#48.1 U?#6.19(VQ)
NetC?#49_1: C?#49.1 U?#6.28(AFILTB)
NetC?#50_1: C?#50.1 U?#6.18(FILT+)
NetJ?#7_2: J?#7.2 R?#31.1 U?#6.14(HP/LINE_OUTB)
NetR?#33_1: R?#33.1 R?#34.2 U?#7.2(L/R)

Not connected (* = marked no-connect by the designer): J?#7 4*; U?#6 20(TSTO)* 21(AIN4A)* 22(AIN4B)* 23(AIN3A)* 24(AIN3B)* 25(AIN2A)* 26(AIN2B)* 29(AIN1A)* 30(AIN1B)* 36(TSTO)*

### Notes on the sheet
- (near U?#6) ADD: 10010100
- Labels drawn without touching a wire or pin: RESET_DAC

### Library data of the parts
C?#34 C?#40 = CAP_22nF-50V-1%-0805
C?#35 C?#36 C?#39 C?#43 C?#45 C?#46 C?#52 = CAP_0.1uF-50V-10%-0805: as C?#1 on sheet STM32F103; Case/Package: 0805; Supplier-1: SIRICOM; Supplier Part Number-1: 0805B104K500CT
C?#37 C?#38 C?#41 C?#42 C?#48 C?#51 = CAP_1uF-50V-5%-0805: as C?#6 on sheet STM32F103; Case/Package: 0805; Supplier-1: SIRICOM; Supplier Part Number-1: CL21B105KBFNNNE
C?#44 C?#50 = CAP_10uF-50V-10%-1206: as C?#11 on sheet Ethernet PHY; Case/Package: 1206; Supplier-1: SIRICOM; Supplier Part Number-1: CC1206KKX5R9BB106
C?#47 C?#49 = CAP_150pF-50V-20%-0805
FB?#2 = FB_1K-100MHZ-1.6A-0805: as FB?#1 on sheet ADC_Chip; Case/Package: 0805; Supplier-1: SIRICOM; Supplier Part Number-1: ACMS201209A102
J?#7 = CON-PLG-STEREO_4X1-100-RA-SMD: 2.50mm (0.094", 3/32", Sub Mini, Miniature) - Headphone Phone Jack Stereo (4 Conductor, TRRS) Connector Solder; Manufacturer: CUI Devices; Manufacturer Part Number: SJ-2504A-SMT-TR; Alternate Part Number-1: NA; Case/Package: SMD; Supplier Part Number-1: CP-SJ-2504A-SMT-CT-ND - Cut Tape (CT); Supplier-1: Digikey
R?#30 R?#31 = RES_51.1R-0.1W-1%-0603: 51.1 Ohms ±1% 0.1W, 1/10W Chip Resistor 0603 (1608 Metric) Thick Film; Manufacturer: Vishay Dale; Manufacturer Part Number: CRCW060351R1FKEAC; Alternate Part Number-1: NA; Case/Package: 0603; Supplier-1: Digikey; Supplier Part Number-1: 541-5468-1-ND - Cut Tape (CT)
R?#32-R?#34 = RES_10K-0.125W-1%-0805: as R?#4 on sheet STM32F103; Case/Package: 0805; Supplier-1: SIRICOM; Supplier Part Number-1: WR08X1002FTL; Alternate Part Number-1: WR08X1002FTL
U?#6 = IC_CS43L22: Audio D/A Converter ICs Low Power Stereo DAC w/ClassD Spkr Driver; Manufacturer: Cirrus Logic; Alternate Part Number-1: NA; Manufacturer Part Number: CS43L22-CNZ; Case/Package: QFN-40; Supplier-1: Mouser; Supplier Part Number-1: 777-CS43L22-CNZ
U?#7 = IC_IMP34DT05T

## Sheet Motor_Driver_2.SchDoc
size A4; SheetNumber: 9; SheetTotal: 10
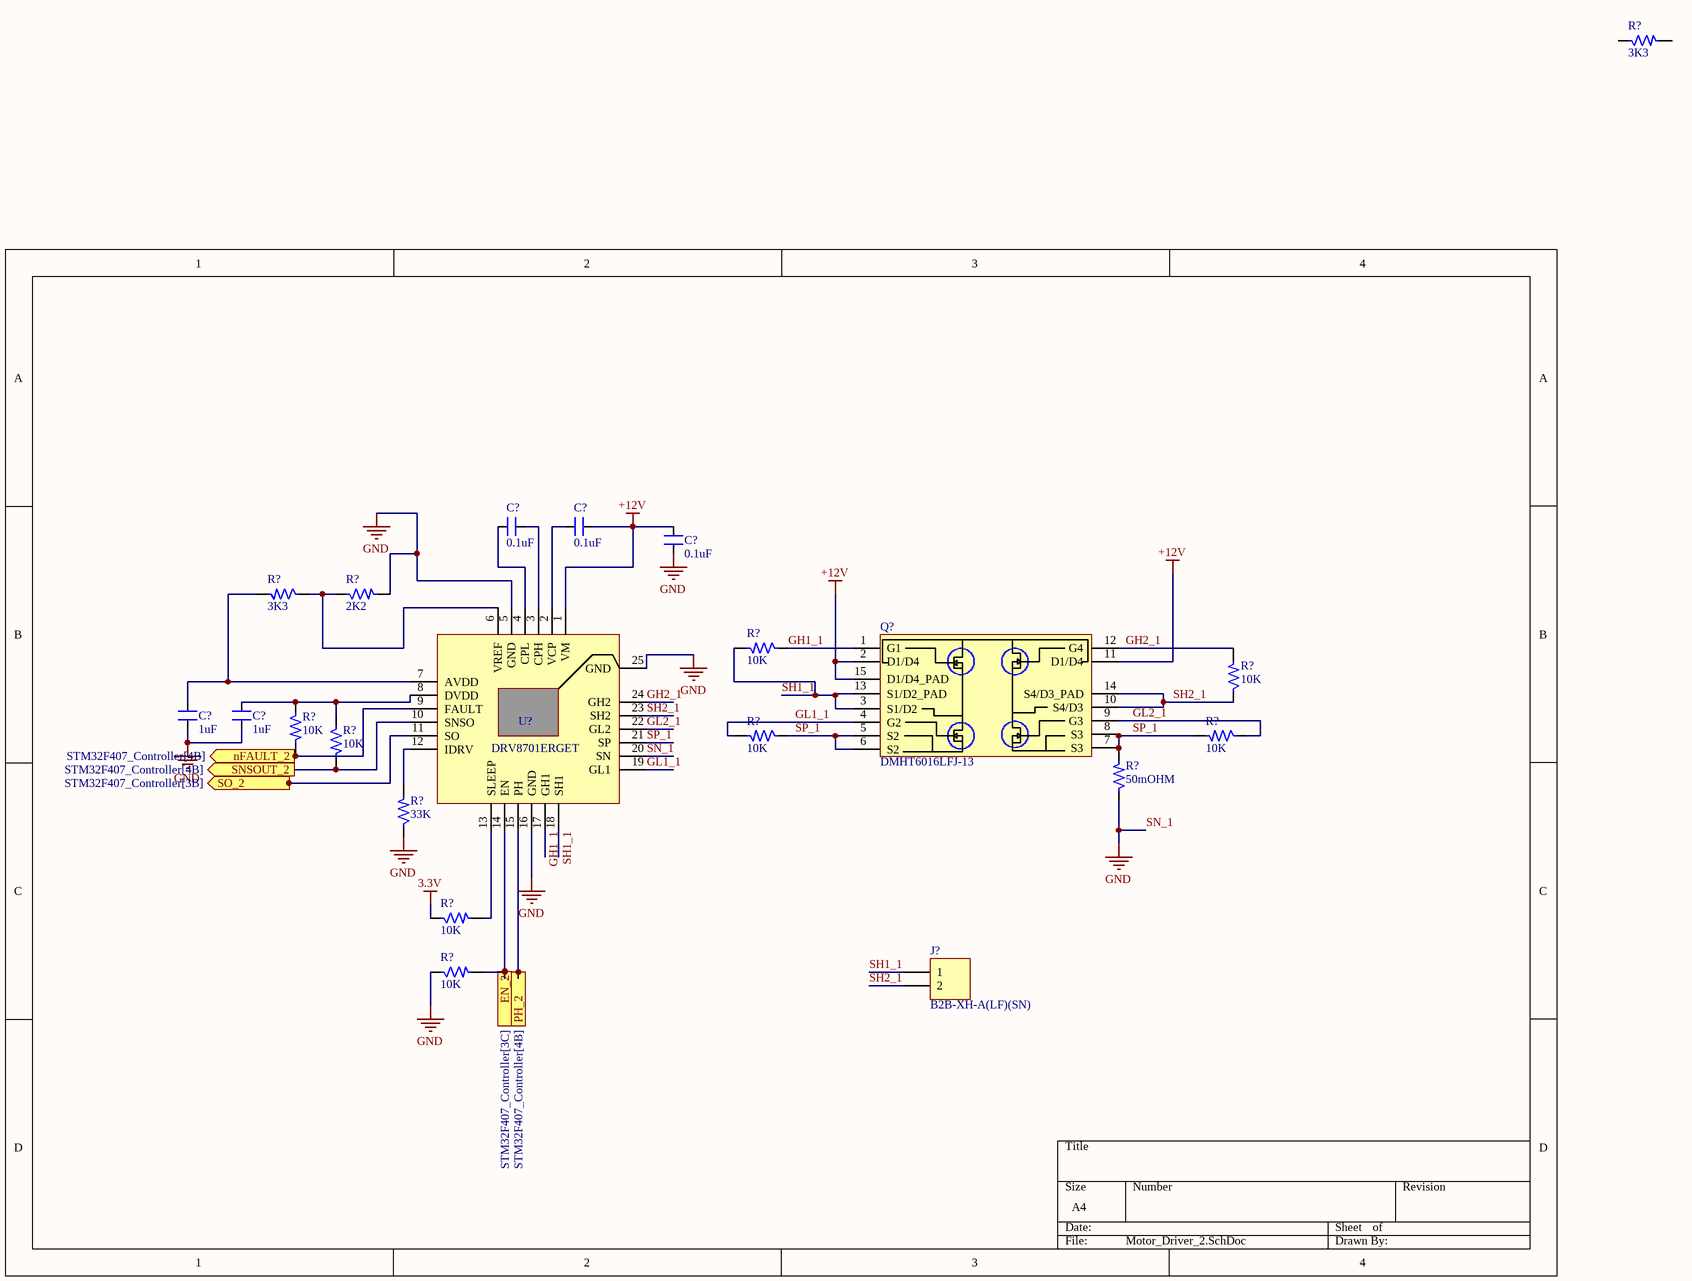
[diagram p8: Motor_Driver_2.SchDoc]

### Parts
(Parts that share a designator on the sheet are numbered #1, #2 ... from top to bottom, then left to right.)
C?#53  0.1uF  [CAP_0805]
C?#54  0.1uF  [CAP_0805]
C?#55  0.1uF  [CAP_0805]
C?#56  1uF  [CAP_0805]
C?#57  1uF  [CAP_0805]
J?#8  B2B-XH-A(LF)(SN)  [CON2_100_B2B-XH-A_TH_ST]
Q?#2  DMHT6016LFJ-13  [DFN5045-12_33_212_27X15_SMD_1]
R?#35  3K3  [RES_0603]
R?#36  3K3  [RES_0603]
R?#37  2K2  [RES_0603]
R?#38  10K  [RES_0805]
R?#39  10K  [RES_0805]
R?#40  10K  [RES_0805]
R?#41  10K  [RES_0805]
R?#42  10K  [RES_0805]
R?#43  10K  [RES_0805]
R?#44  50mOHM  [RES_2512]
R?#45  33K  [RES_0805]
R?#46  10K  [RES_0603]
R?#47  10K  [RES_0805]
U?#8  DRV8701ERGET  [VFQFN24_19.6_196_12X32_SMD_1]

### Ports
EN_2 (in, see STM32F407_Controller[3C]), nFAULT_2 (out, see STM32F407_Controller[4B]), PH_2 (in, see STM32F407_Controller[4B]), SNSOUT_2 (out, see STM32F407_Controller[4B]), SO_2 (out, see STM32F407_Controller[3B])

### Nets
3.3V: R?#46.1
+12V: C?#54.1 C?#55.2 Q?#2.2(D1/D4) Q?#2.11(D1/D4) Q?#2.15(D1/D4_PAD) U?#8.1(VM)
GND: C?#55.1 C?#56.1 C?#57.1 R?#37.2 R?#44.1 R?#45.1 R?#47.1 U?#8.5(GND) U?#8.16(GND) U?#8.20(SN) U?#8.25(GND)  [also labelled SN_1]  [project net SN]
EN_2: R?#47.2 U?#8.14(EN) ; port EN_2
GH1_1: Q?#2.1(G1) R?#38.1 U?#8.17(GH1)
GH2_1: Q?#2.12(G4) R?#40.2 U?#8.24(GH2)
GL1_1: Q?#2.4(G2) R?#42.2 U?#8.19(GL1)
GL2_1: Q?#2.9(G3) R?#43.1 U?#8.22(GL2)
nFAULT_2: R?#39.2 U?#8.9(FAULT) ; port nFAULT_2
PH_2: U?#8.15(PH) ; port PH_2
SH1_1: J?#8.1 Q?#2.3(S1/D2) Q?#2.13(S1/D2_PAD) R?#38.2 U?#8.18(SH1)
SH2_1: J?#8.2 Q?#2.10(S4/D3) Q?#2.14(S4/D3_PAD) R?#40.1 U?#8.23(SH2)
SNSOUT_2: R?#41.2 U?#8.10(SNSO) ; port SNSOUT_2
SO_2: U?#8.11(SO) ; port SO_2
SP_1: Q?#2.5(S2) Q?#2.6(S2) Q?#2.7(S3) Q?#2.8(S3) R?#42.1 R?#43.2 R?#44.2 U?#8.21(SP)
NetC?#53_1: C?#53.1 U?#8.3(CPH)
NetC?#53_2: C?#53.2 U?#8.4(CPL)
NetC?#54_2: C?#54.2 U?#8.2(VCP)
NetC?#56_2: C?#56.2 R?#36.2 U?#8.7(AVDD)
NetC?#57_2: C?#57.2 R?#39.1 R?#41.1 U?#8.8(DVDD)
NetR?#36_1: R?#36.1 R?#37.1 U?#8.6(VREF)
NetR?#45_2: R?#45.2 U?#8.12(IDRV)
NetR?#46_2: R?#46.2 U?#8.13(SLEEP)

Not connected (* = marked no-connect by the designer): R?#35 1 2

### Library data of the parts
C?#53-C?#55 = CAP_0.1uF-50V-20%-0805: as C?#22 on sheet Motor_Driver_Schematic; Case/Package: 0805; Supplier-1: SIRICOM; Supplier Part Number-1: 0805B104K500CT
C?#56 C?#57 = CAP_1uF-50V-5%-0805: as C?#6 on sheet STM32F103; Case/Package: 0805; Supplier-1: SIRICOM; Supplier Part Number-1: CL21B105KBFNNNE
J?#8 = CON-PLG_2X1-100-ST-TH: as J?#4 on sheet Motor_Driver_Schematic; Manufacturer Part Number: B2B-XH-A(LF)(SN); Case/Package: TH-CON; Supplier-1: SP ROAD; Supplier Part Number-1: B2B-XH-A(LF)(SN)
Q?#2 = MOSFET-N_60V-14.8A-V-DFN5045-12: as Q?#1 on sheet Motor_Driver_Schematic; Manufacturer Part Number: DMHT6016LFJ-13; Case/Package: DFN5045-12; Supplier-1: LCSC; Supplier Part Number-1: C460986
R?#35 R?#36 = RES_3.3K-0.1W-1%-0603: as R?#5 on sheet Ethernet PHY; Case/Package: 0603; Supplier-1: SIRICOM; Supplier Part Number-1: WR06X3301FTL
R?#37 = RES_2K2-0.1W-5%-0603: as R?#14 on sheet Motor_Driver_Schematic; Case/Package: 0603; Supplier-1: SIRICOM; Supplier Part Number-1: WR06X2201FTL
R?#38-R?#43 R?#47 = RES_10K-0.125W-1%-0805: as R?#4 on sheet STM32F103; Case/Package: 0805; Supplier-1: SIRICOM; Supplier Part Number-1: WR08X1002FTL; Alternate Part Number-1: WR08X1002FTL
R?#44 = RES_50mOhm-2W-1%-2512: as R?#21 on sheet Motor_Driver_Schematic; Case/Package: 2512; Supplier-1: SIRICOM; Supplier Part Number-1: LR2512-22R060F1
R?#45 = RES_33K-0.125W-1%-0805: as R?#22 on sheet Motor_Driver_Schematic; Case/Package: 0805; Supplier-1: SIRICOM; Supplier Part Number-1: WR08X3302FTL
R?#46 = RES_10K-0.1W-1%-0603: as R?#23 on sheet Motor_Driver_Schematic; Case/Package: 0603; Supplier-1: SIRICOM; Supplier Part Number-1: WR06X1002FTL
U?#8 = IC_DRV8701ERGET: as U?#3 on sheet Motor_Driver_Schematic; Manufacturer Part Number: DRV8701ERGET; Case/Package: VFQFN24; Supplier-1: ARROW; Supplier Part Number-1: DRV8701ERGET

## Sheet STM32F407_Controller.SchDoc
size 420 x 297 mm; SheetNumber: 10; SheetTotal: 11
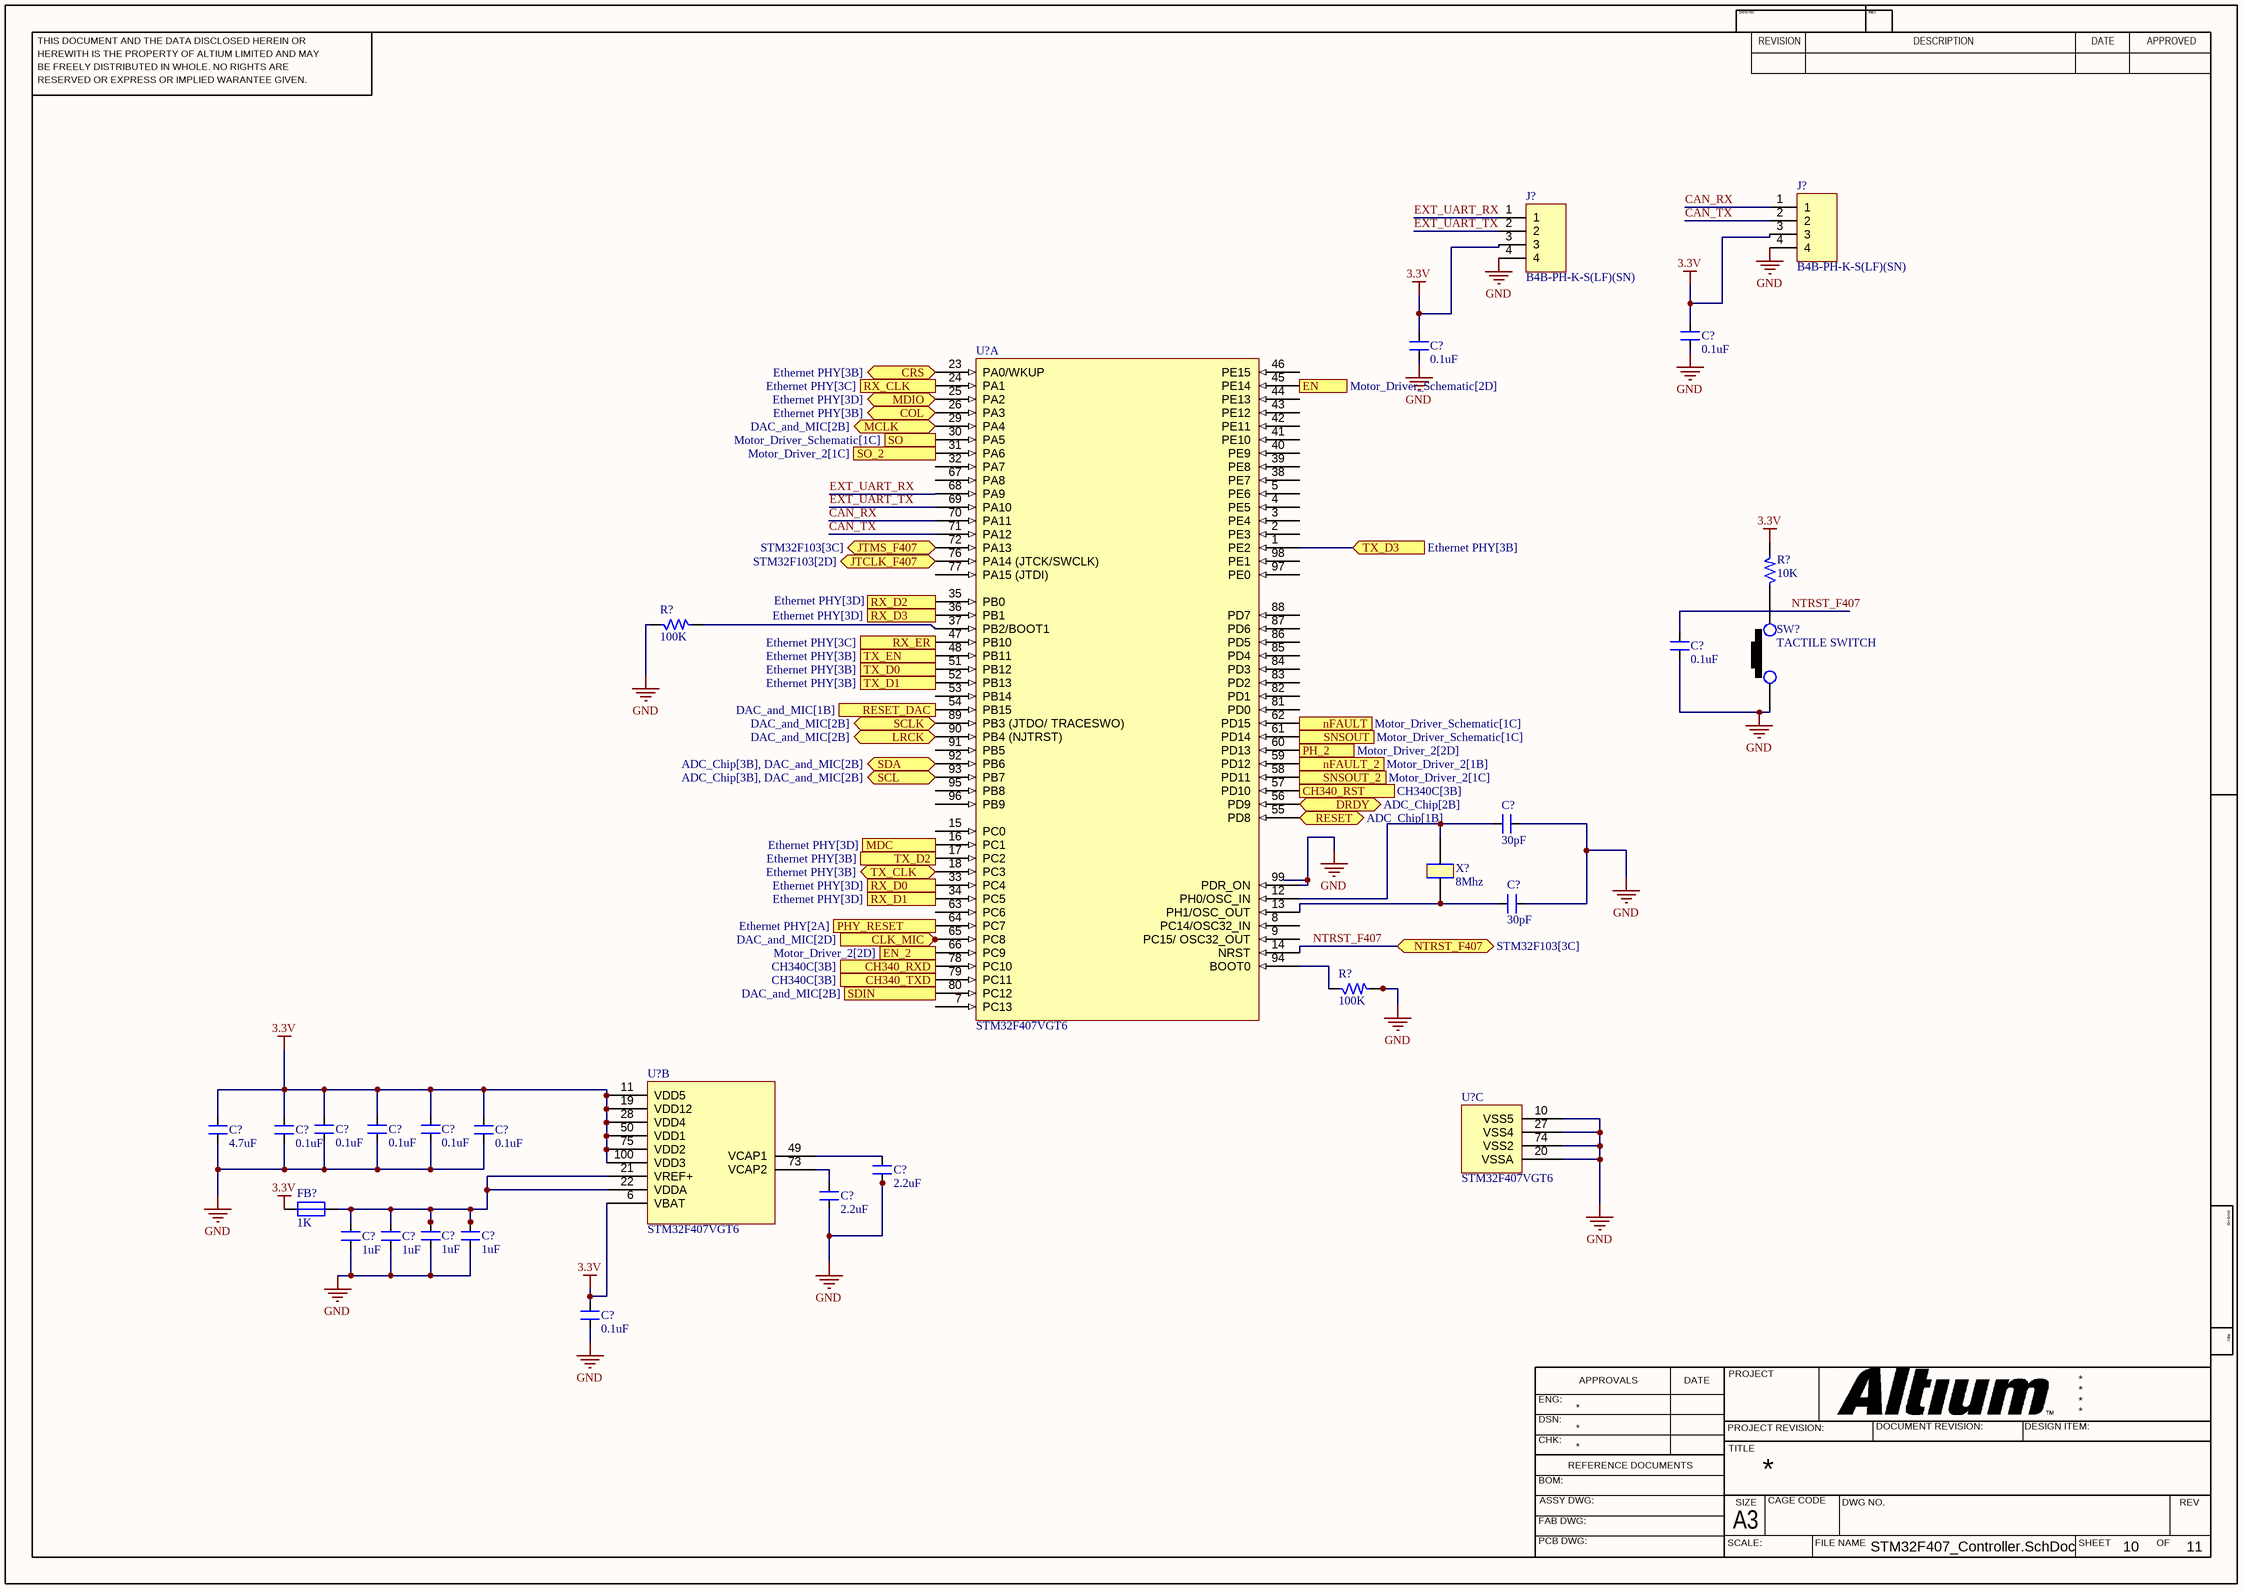
[diagram p9: STM32F407_Controller.SchDoc]

### Parts
(Parts that share a designator on the sheet are numbered #1, #2 ... from top to bottom, then left to right.)
C?#58  0.1uF  [CAP_0805]
C?#59  0.1uF  [CAP_0805]
C?#60  0.1uF  [CAP_0805]
C?#61  30pF  [CAP_0805]
C?#62  30pF  [CAP_0805]
C?#63  4.7uF  [CAP_0805]
C?#64  0.1uF  [CAP_0805]
C?#65  0.1uF  [CAP_0805]
C?#66  0.1uF  [CAP_0805]
C?#67  0.1uF  [CAP_0805]
C?#68  0.1uF  [CAP_0805]
C?#69  2.2uF  [CAP_0805]
C?#70  2.2uF  [CAP_0805]
C?#71  1uF  [CAP_0805]
C?#72  1uF  [CAP_0805]
C?#73  1uF  [CAP_0805]
C?#74  1uF  [CAP_0805]
C?#75  0.1uF  [CAP_0805]
FB?#3  1K  [IND_0805]
J?#9  B4B-PH-K-S(LF)(SN)  [CON4_78_B4B-PH-K-S(LF)(SN)]
J?#10  B4B-PH-K-S(LF)(SN)  [CON4_78_B4B-PH-K-S(LF)(SN)]
R?#48  10K  [RES_0805]
R?#49  100K  [RES_0805]
R?#50  100K  [RES_0805]
SW?#3  TACTILE SWITCH  [SW_342_SMD]
U?#9  STM32F407VGT6  [QFN100_19.6_669_58X10_SMD]  (part A of 3)
U?#10  STM32F407VGT6  [QFN100_19.6_669_58X10_SMD]  (part B of 3)
U?#11  STM32F407VGT6  [QFN100_19.6_669_58X10_SMD]  (part C of 3)
X?#2  8Mhz  [XTAL_314_240X47_SMD]

### Ports
CH340_RST (out, see CH340C[3B]), CH340_RXD (out, see CH340C[3B]), CH340_TXD (out, see CH340C[3B]), CLK_MIC (in, see DAC_and_MIC[2D]), COL (bidir, see Ethernet PHY[3B]), CRS (bidir, see Ethernet PHY[3B]), DRDY (bidir, see ADC_Chip[2B]), EN (in, see Motor_Driver_Schematic[2D]), EN_2 (in, see Motor_Driver_2[2D]), JTCLK_F407 (bidir, see STM32F103[2D]), JTMS_F407 (bidir, see STM32F103[3C]), LRCK (bidir, see DAC_and_MIC[2B]), MCLK (bidir, see DAC_and_MIC[2B]), MDC (in, see Ethernet PHY[3D]), MDIO (bidir, see Ethernet PHY[3D]), nFAULT (out, see Motor_Driver_Schematic[1C]), nFAULT_2 (out, see Motor_Driver_2[1B]), NTRST_F407 (bidir, see STM32F103[3C]), PH_2 (in, see Motor_Driver_2[2D]), PHY_RESET (in, see Ethernet PHY[2A]), RESET (bidir, see ADC_Chip[1B]), RESET_DAC (in, see DAC_and_MIC[1B]), RX_CLK (in, see Ethernet PHY[3C]), RX_D0 (in, see Ethernet PHY[3D]), RX_D1 (in, see Ethernet PHY[3D]), RX_D2 (in, see Ethernet PHY[3D]), RX_D3 (in, see Ethernet PHY[3D]), RX_ER (out, see Ethernet PHY[3C]), SCL (bidir, see ADC_Chip[3B], DAC_and_MIC[2B]), SCLK (bidir, see DAC_and_MIC[2B]), SDA (bidir, see ADC_Chip[3B], DAC_and_MIC[2B]), SDIN (in, see DAC_and_MIC[2B]), SNSOUT (out, see Motor_Driver_Schematic[1C]), SNSOUT_2 (out, see Motor_Driver_2[1C]), SO (out, see Motor_Driver_Schematic[1C]), SO_2 (out, see Motor_Driver_2[1C]), TX_CLK (bidir, see Ethernet PHY[3B]), TX_D0 (in, see Ethernet PHY[3B]), TX_D1 (in, see Ethernet PHY[3B]), TX_D2 (in, see Ethernet PHY[3B]), TX_D3 (in, see Ethernet PHY[3B]), TX_EN (in, see Ethernet PHY[3B])

### Nets
3.3V: C?#58.2 C?#59.2 C?#63.2 C?#64.2 C?#65.2 C?#66.2 C?#67.2 C?#68.2 C?#75.2 FB?#3.1 J?#9.3 J?#10.3 R?#48.2 U?#10.6(VBAT) U?#10.11(VDD5) U?#10.19(VDD12) U?#10.28(VDD4) U?#10.50(VDD1) U?#10.75(VDD2) U?#10.100(VDD3)
GND: C?#58.1 C?#59.1 C?#60.1 C?#61.2 C?#62.2 C?#63.1 C?#64.1 C?#65.1 C?#66.1 C?#67.1 C?#68.1 C?#69.1 C?#70.1 C?#71.1 C?#72.1 C?#73.1 C?#74.1 C?#75.1 J?#9.4 J?#10.4 R?#49.1 R?#50.2 SW?#3.1 U?#9.99(PDR_ON) U?#11.10(VSS5) U?#11.20(VSSA) U?#11.27(VSS4) U?#11.74(VSS2)  [project net SN]
CAN_RX: J?#9.1 U?#9.70(PA11)
CAN_TX: J?#9.2 U?#9.71(PA12)
CH340_RST: U?#9.57(PD10) ; port CH340_RST
CH340_RXD: U?#9.78(PC10) ; port CH340_RXD
CH340_TXD: U?#9.79(PC11) ; port CH340_TXD
CLK_MIC: U?#9.65(PC8) ; port CLK_MIC
COL: U?#9.26(PA3) ; port COL
CRS: U?#9.23(PA0/WKUP) ; port CRS
DRDY: U?#9.56(PD9) ; port DRDY
EN: U?#9.45(PE14) ; port EN
EN_2: U?#9.66(PC9) ; port EN_2
EXT_UART_RX: J?#10.1 U?#9.68(PA9)
EXT_UART_TX: J?#10.2 U?#9.69(PA10)
JTCLK_F407: U?#9.76(PA14_(JTCK/SWCLK)) ; port JTCLK_F407
JTMS_F407: U?#9.72(PA13) ; port JTMS_F407
LRCK: U?#9.90(PB4_(NJTRST)) ; port LRCK
MCLK: U?#9.29(PA4) ; port MCLK
MDC: U?#9.16(PC1) ; port MDC
MDIO: U?#9.25(PA2) ; port MDIO
nFAULT: U?#9.62(PD15) ; port nFAULT
nFAULT_2: U?#9.59(PD12) ; port nFAULT_2
NTRST_F407: C?#60.2 U?#9.14(NRST) ; port NTRST_F407
PH_2: U?#9.60(PD13) ; port PH_2
PHY_RESET: U?#9.64(PC7) ; port PHY_RESET
RESET: U?#9.55(PD8) ; port RESET
RESET_DAC: U?#9.54(PB15) ; port RESET_DAC
RX_CLK: U?#9.24(PA1) ; port RX_CLK
RX_D0: U?#9.33(PC4) ; port RX_D0
RX_D1: U?#9.34(PC5) ; port RX_D1
RX_D2: U?#9.35(PB0) ; port RX_D2
RX_D3: U?#9.36(PB1) ; port RX_D3
RX_ER: U?#9.47(PB10) ; port RX_ER
SCL: U?#9.93(PB7) ; port SCL
SCLK: U?#9.89(PB3_(JTDO/_TRACESWO)) ; port SCLK
SDA: U?#9.92(PB6) ; port SDA
SDIN: U?#9.80(PC12) ; port SDIN
SNSOUT: U?#9.61(PD14) ; port SNSOUT
SNSOUT_2: U?#9.58(PD11) ; port SNSOUT_2
SO: U?#9.30(PA5) ; port SO
SO_2: U?#9.31(PA6) ; port SO_2
TX_CLK: U?#9.18(PC3) ; port TX_CLK
TX_D0: U?#9.51(PB12) ; port TX_D0
TX_D1: U?#9.52(PB13) ; port TX_D1
TX_D2: U?#9.17(PC2) ; port TX_D2
TX_D3: U?#9.1(PE2) ; port TX_D3
TX_EN: U?#9.48(PB11) ; port TX_EN
NetC?#61_1: C?#61.1 U?#9.12(PH0/OSC_IN) X?#2.2
NetC?#62_1: C?#62.1 U?#9.13(PH1/OSC_OUT) X?#2.1
NetC?#69_2: C?#69.2 U?#10.49(VCAP1)
NetC?#70_2: C?#70.2 U?#10.73(VCAP2)
NetC?#71_2: C?#71.2 C?#72.2 C?#73.2 C?#74.2 FB?#3.2 U?#10.21(VREF+) U?#10.22(VDDA)
NetR?#48_1: R?#48.1 SW?#3.2
NetR?#49_2: R?#49.2 U?#9.37(PB2/BOOT1)
NetR?#50_1: R?#50.1 U?#9.94(BOOT0)

Not connected (* = marked no-connect by the designer): U?#9 2(PE3) 3(PE4) 4(PE5) 5(PE6) 7(PC13) 8(PC14/OSC32_IN) 9(PC15/_OSC32_OUT) 15(PC0) 32(PA7) 38(PE7) 39(PE8) 40(PE9) 41(PE10) 42(PE11) 43(PE12) 44(PE13) 46(PE15) 53(PB14) 63(PC6) 67(PA8) 77(PA15_(JTDI)) 81(PD0) 82(PD1) 83(PD2) 84(PD3) 85(PD4) 86(PD5) 87(PD6) 88(PD7) 91(PB5) 95(PB8) 96(PB9) 97(PE0) 98(PE1)

### Notes on the sheet
- THIS DOCUMENT AND THE DATA DISCLOSED HEREIN OR
- HEREWITH IS THE PROPERTY OF ALTIUM LIMITED AND MAY
- DWG NO:
- REVISION
- REV:
- DESCRIPTION
- DATE
- APPROVED
- BE FREELY DISTRIBUTED IN WHOLE. NO RIGHTS ARE
- RESERVED OR EXPRESS OR IMPLIED WARANTEE GIVEN.
- ENG:
- APPROVALS
- PROJECT
- DSN:
- CHK:
- REFERENCE DOCUMENTS
- PROJECT REVISION:
- TITLE
- DOCUMENT REVISION:
- DESIGN ITEM:
- BOM:
- FAB DWG:
- PCB DWG:
- ASSY DWG:
- SCALE:
- A3
- SIZE
- CAGE CODE
- FILE NAME
- DWG NO.
- SHEET
- OF
- REV

### Library data of the parts
C?#58-C?#60 C?#64-C?#68 C?#75 = CAP_0.1uF-50V-10%-0805: as C?#1 on sheet STM32F103; Case/Package: 0805; Supplier-1: SIRICOM; Supplier Part Number-1: 0805B104K500CT
C?#61 C?#62 = CAP_30pF-50V-10%-0805: as C?#5 on sheet STM32F103; Case/Package: 0805; Supplier-1: Digikey; Supplier Part Number-1: 399-17443-1-ND - Cut Tape (CT)
C?#63 = CAP_4.7uF-50V-10%-0805: as C?#2 on sheet STM32F103; Case/Package: 0805; Supplier-1: SIRICOM; Supplier Part Number-1: CL21A475KBQNNNE
C?#69 C?#70 = CAP_2.2uF-25V-10%-0805: 2.2µF ±10% 25V Ceramic Capacitor X7R 0805 (2012 Metric); Manufacturer: KEMET; Manufacturer Part Number: CL21B225KAFNFNE; Alternate Part Number-1: NA; Case/Package: 0805; Supplier-1: SIRICOM; Supplier Part Number-1: CL21A225KAFNNNE
C?#71-C?#74 = CAP_1uF-50V-5%-0805: as C?#6 on sheet STM32F103; Case/Package: 0805; Supplier-1: SIRICOM; Supplier Part Number-1: CL21B105KBFNNNE
FB?#3 = FB_1K-100MHZ-1.6A-0805: as FB?#1 on sheet ADC_Chip; Case/Package: 0805; Supplier-1: SIRICOM; Supplier Part Number-1: ACMS201209A102
J?#9 J?#10 = CON-PLG_4X1-78-ST-TH: Connector Header Through Hole 4 position 0.079" (2.00mm); Manufacturer: JST; Mating Part Number: PHR-4; Crimp Part Number: ASPHSPH24K51; Alternate Part Number-1: NA; Manufacturer Part Number: B4B-PH-K-S(LF)(SN); Case/Package: TH; Supplier-1: SP Road; Supplier Part Number-1: NA
R?#48 = RES_10K-0.125W-1%-0805: as R?#4 on sheet STM32F103; Case/Package: 0805; Supplier-1: SIRICOM; Supplier Part Number-1: WR08X1002FTL; Alternate Part Number-1: WR08X1002FTL
R?#49 R?#50 = RES_100K-0.125W-1%-0805: as R?#25 on sheet ADC_Chip; Case/Package: 0805; Supplier-1: SIRICOM; Supplier Part Number-1: WR08X1003FTL
SW?#3 = SW1_RS-282G05A3-SMRT-SMD: as SW?#1 on sheet STM32F103; Manufacturer Part Number: RS-282G05A3-SMRT; Case/Package: SMD; Supplier-1: SP ROAD; Supplier Part Number-1: RS-282G05A3-SMRT
U?#9-U?#11 = IC_STM32F407VGT6: ARM® Cortex®-M4 STM32F4 Microcontroller IC 32-Bit 168MHz 1MB (1M x 8) FLASH 100-LQFP (14x14); Manufacturer: STMicroelectronics; Alternate Part Number-1: STM32F407VET6; Manufacturer Part Number: STM32F407VGT6; Case/Package: LQFP100; Supplier-1: ARROW; Supplier Part Number-1: STM32F407VGT6
X?#2 = XTAL_8MHZ-ECS-80-32-5PX-SMD: as X?#1 on sheet STM32F103; Case/Package: SMD/SMT; Supplier-1: SP ROAD; Supplier Part Number-1: ECS-80-32-5PX-TR

## Sheet Power_input_and_regulators.SchDoc
size A4; SheetNumber: 11; SheetTotal: 11
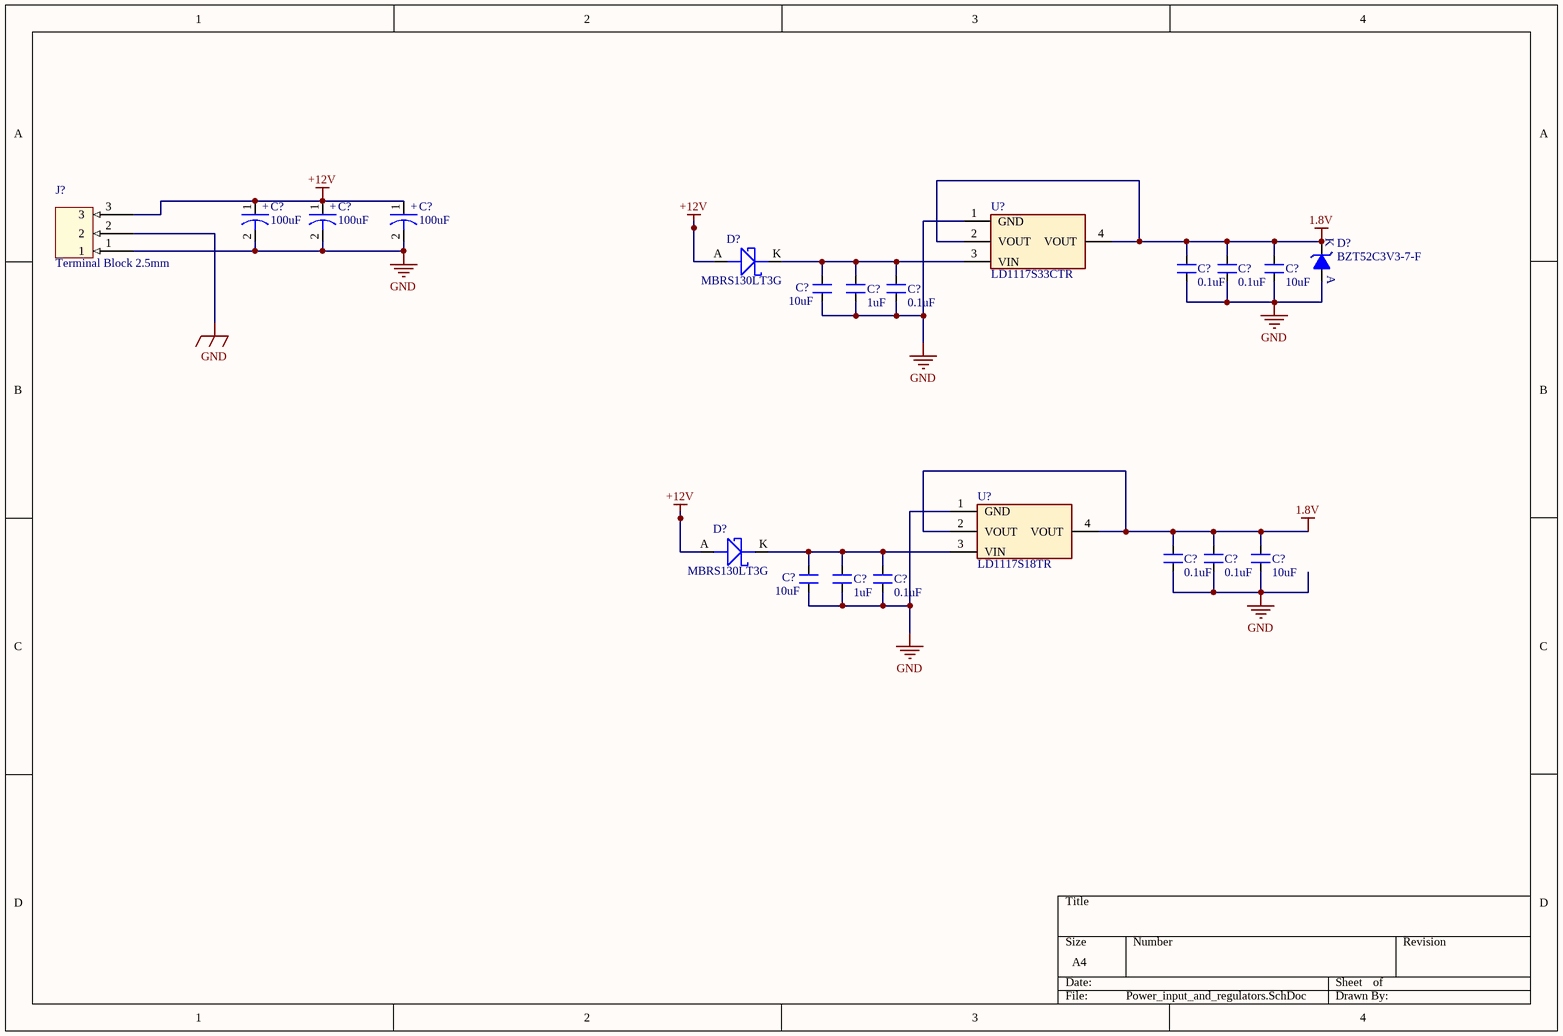
[diagram p10: Power_input_and_regulators.SchDoc]

### Parts
(Parts that share a designator on the sheet are numbered #1, #2 ... from top to bottom, then left to right.)
C?#76  100uF  [ACAP_P236_D305_H303_RAD]
C?#77  100uF  [ACAP_P236_D305_H303_RAD]
C?#78  100uF  [ACAP_P236_D305_H303_RAD]
C?#79  0.1uF  [CAP_0805]
C?#80  0.1uF  [CAP_0805]
C?#81  10uF  [CAP_1206]
C?#82  10uF  [CAP_1206]
C?#83  1uF  [CAP_0805]
C?#84  0.1uF  [CAP_0805]
C?#85  0.1uF  [CAP_0805]
C?#86  0.1uF  [CAP_0805]
C?#87  10uF  [CAP_1206]
C?#88  10uF  [CAP_1206]
C?#89  1uF  [CAP_0805]
C?#90  0.1uF  [CAP_0805]
D?#5  MBRS130LT3G  [DIO_SMB_DO-214AA]
D?#6  BZT52C3V3-7-F  [DIO_SOD-123]
D?#7  MBRS130LT3G  [DIO_SMB_DO-214AA]
J?#11  Terminal Block 2.5mm  [CON3_100_TB_TH_ST]
U?#12  LD1117S33CTR  [SOT223_3]
U?#13  LD1117S18TR  [SOT223_3]

### Nets
1.8V: C?#79.2 C?#80.2 C?#81.2 C?#85.2 C?#86.2 C?#87.2 D?#6.K U?#12.2(VOUT) U?#12.4(VOUT) U?#13.2(VOUT) U?#13.4(VOUT)
+12V: C?#76.1 C?#77.1 C?#78.1 D?#5.A D?#7.A J?#11.3
GND: C?#76.2 C?#77.2 C?#78.2 C?#79.1 C?#80.1 C?#81.1 C?#82.1 C?#83.1 C?#84.1 C?#85.1 C?#86.1 C?#87.1 C?#88.1 C?#89.1 C?#90.1 D?#6.A J?#11.1 J?#11.2 U?#12.1(GND) U?#13.1(GND)  [project net SN]
NetC?#82_2: C?#82.2 C?#83.2 C?#84.2 D?#5.K U?#12.3(VIN)
NetC?#88_2: C?#88.2 C?#89.2 C?#90.2 D?#7.K U?#13.3(VIN)

### Notes on the sheet
- (in symbol CAP-P_100uF-25V-20%-RAD) +

### Library data of the parts
C?#76-C?#78 = CAP-P_100uF-25V-20%-RAD: 100µF 25V Aluminum Electrolytic Capacitors Radial, Can - SMD 1000 Hrs @ 105°C; Manufacturer: Nichicon; Manufacturer Part Number: UWT1E101MCL1GS; Alternate Part Number-1: NA; Case/Package: Radial-SMD; Supplier-1: SP ROAD; Supplier Part Number-1: UWT1E101MCL1GS
C?#79 C?#85 = CAP_0.1uF-50V-10%-0805: as C?#1 on sheet STM32F103; Case/Package: 0805; Supplier-1: SIRICOM; Supplier Part Number-1: 0805B104K500CT
C?#80 C?#84 C?#86 C?#90 = CAP_0.1uF-50V-20%-0805: as C?#22 on sheet Motor_Driver_Schematic; Case/Package: 0805; Supplier-1: SIRICOM; Supplier Part Number-1: 0805B104K500CT
C?#81 C?#82 C?#87 C?#88 = CAP_10uF-50V-10%-1206: as C?#11 on sheet Ethernet PHY; Case/Package: 1206; Supplier-1: SIRICOM; Supplier Part Number-1: CC1206KKX5R9BB106
C?#83 C?#89 = CAP_1uF-50V-5%-0805: as C?#6 on sheet STM32F103; Case/Package: 0805; Supplier-1: SIRICOM; Supplier Part Number-1: CL21B105KBFNNNE
D?#5 D?#7 = DIO-S_445mV-30V-2A-SMB: Diode Schottky 30V 2A Surface Mount SMB; Manufacturer: ON Semiconductor; Alternate Part Number-1: NA; Manufacturer Part Number: MBRS130LT3G; Case/Package: SMB; Supplier-1: ARROW; Supplier Part Number-1: MBRS130LT3G
D?#6 = DIO-Z_3.3V-500mW-SOD123: Zener Diode 3.3V 500mW ±6% Surface Mount SOD-123; Manufacturer: Diodes Incorporated; Alternate Part Number-1: NA; Manufacturer Part Number: BZT52C3V3-7-F; Case/Package: SOD-123; Supplier-1: Digikey; Supplier Part Number-1: BZT52C3V3-FDICT-ND
J?#11 = CON-TB_3X1-100-ST-TH: 3 Pins, 1 Row 2.54mm Pitch, straight Connector, male; Manufacturer Part Number: 1725669; Manufacturer: Phoenix Contact; Alternate Part Number-1: NA; Case/Package: TH-CON; Supplier-1: SP ROAD; Supplier Part Number-1: 1725669
U?#12 = REG_15V-3.3V-0.9A-12W-SOT223: Linear Voltage Regulator IC 1 Output 800mA SOT-223; Manufacturer: STMicroelectronics; Alternate Part Number-1: NA; Manufacturer Part Number: LD1117S33CTR; Case/Package: SOT223; Supplier-1: SP ROAD; Supplier Part Number-1: LD1117S33CTR
U?#13 = REG_15V-1.8V-0.8A-1.4W-SOT223: LDO Voltage Regulators 1.8V 0.8A Positive; Manufacturer: STMicroelectronics; Alternate Part Number-1: NA; Manufacturer Part Number: LD1117S18TR; Case/Package: SOT-223-3; Supplier-1: Mouser; Supplier Part Number-1: 511-LD1117S18-TR

## Nets that join several sheets
1.8V: DAC_and_MIC (C?#38.1 C?#39.2 FB?#2.1 U?#6.34), Power_input_and_regulators (11 pins)
3.3V: STM32F103 (14 pins), Motor_Driver_Schematic (R?#23.1), CH340C (C?#27.2 U?#4.4 U?#4.16), ADC_Chip (7 pins), DAC_and_MIC (12 pins), Motor_Driver_2 (R?#46.1), STM32F407_Controller (20 pins)
+12V: Motor_Driver_Schematic (6 pins), Motor_Driver_2 (6 pins), Power_input_and_regulators (6 pins)
SN: STM32F103 (19 pins), Ethernet PHY (20 pins), Motor_Driver_Schematic (11 pins), CH340C (C?#27.1 J?#5.5 J?#5.6 U?#4.1), ADC_Chip (9 pins), DAC_and_MIC (28 pins), Motor_Driver_2 (11 pins), STM32F407_Controller (28 pins), Power_input_and_regulators (20 pins)
CH340_RST: CH340C (U?#4.14), STM32F407_Controller (U?#9.57)
CH340_RXD: CH340C (U?#4.3), STM32F407_Controller (U?#9.78)
CH340_TXD: CH340C (U?#4.2), STM32F407_Controller (U?#9.79)
CLK_MIC: DAC_and_MIC (U?#7.4), STM32F407_Controller (U?#9.65)
COL: Ethernet PHY (DS?#2.A U?#2.28), STM32F407_Controller (U?#9.26)
CRS: Ethernet PHY (DS?#1.A U?#2.29), STM32F407_Controller (U?#9.23)
DRDY: ADC_Chip (U?#5.14), STM32F407_Controller (U?#9.56)
EN: Motor_Driver_Schematic (R?#24.2 U?#3.14), STM32F407_Controller (U?#9.45)
EN_2: Motor_Driver_2 (R?#47.2 U?#8.14), STM32F407_Controller (U?#9.66)
JTCLK_F407: STM32F103 (U?#1.18), STM32F407_Controller (U?#9.76)
JTMS_F407: STM32F103 (U?#1.25 U?#1.27), STM32F407_Controller (U?#9.72)
LRCK: DAC_and_MIC (U?#6.40), STM32F407_Controller (U?#9.90)
MCLK: DAC_and_MIC (U?#6.37), STM32F407_Controller (U?#9.29)
MDC: Ethernet PHY (U?#2.12), STM32F407_Controller (U?#9.16)
MDIO: Ethernet PHY (R?#9.1 U?#2.11), STM32F407_Controller (U?#9.25)
nFAULT: Motor_Driver_Schematic (R?#16.2 U?#3.9), STM32F407_Controller (U?#9.62)
nFAULT_2: Motor_Driver_2 (R?#39.2 U?#8.9), STM32F407_Controller (U?#9.59)
NTRST_F407: STM32F103 (U?#1.26), STM32F407_Controller (C?#60.2 U?#9.14)
PH_2: Motor_Driver_2 (U?#8.15), STM32F407_Controller (U?#9.60)
PHY_RESET: Ethernet PHY (R?#7.1 SW?#2.2 U?#2.32), STM32F407_Controller (U?#9.64)
RESET: ADC_Chip (R?#25.2 U?#5.3), STM32F407_Controller (U?#9.55)
RESET_DAC: DAC_and_MIC (U?#6.32), STM32F407_Controller (U?#9.54)
RX_CLK: Ethernet PHY (U?#2.19), STM32F407_Controller (U?#9.24)
RX_D0: Ethernet PHY (U?#2.16), STM32F407_Controller (U?#9.33)
RX_D1: Ethernet PHY (U?#2.15), STM32F407_Controller (U?#9.34)
RX_D2: Ethernet PHY (U?#2.14), STM32F407_Controller (U?#9.35)
RX_D3: Ethernet PHY (U?#2.13), STM32F407_Controller (U?#9.36)
RX_ER: Ethernet PHY (U?#2.20), STM32F407_Controller (U?#9.47)
SCL: ADC_Chip (R?#26.1 U?#5.16), DAC_and_MIC (U?#6.2), STM32F407_Controller (U?#9.93)
SCLK: DAC_and_MIC (U?#6.38), STM32F407_Controller (U?#9.89)
SDA: ADC_Chip (R?#27.1 U?#5.15), DAC_and_MIC (U?#6.1), STM32F407_Controller (U?#9.92)
SDIN: DAC_and_MIC (U?#6.39), STM32F407_Controller (U?#9.80)
SNSOUT: Motor_Driver_Schematic (R?#18.2 U?#3.10), STM32F407_Controller (U?#9.61)
SNSOUT_2: Motor_Driver_2 (R?#41.2 U?#8.10), STM32F407_Controller (U?#9.58)
SO: Motor_Driver_Schematic (U?#3.11), STM32F407_Controller (U?#9.30)
SO_2: Motor_Driver_2 (U?#8.11), STM32F407_Controller (U?#9.31)
TX_CLK: Ethernet PHY (U?#2.22), STM32F407_Controller (U?#9.18)
TX_D0: Ethernet PHY (U?#2.24), STM32F407_Controller (U?#9.51)
TX_D1: Ethernet PHY (U?#2.25), STM32F407_Controller (U?#9.52)
TX_D2: Ethernet PHY (U?#2.26), STM32F407_Controller (U?#9.17)
TX_D3: Ethernet PHY (U?#2.27), STM32F407_Controller (U?#9.1)
TX_EN: Ethernet PHY (U?#2.23), STM32F407_Controller (U?#9.48)